# EAGLE design MBHP_CORE_STM32F4v1.1.12 (EAGLE 7.1.0)
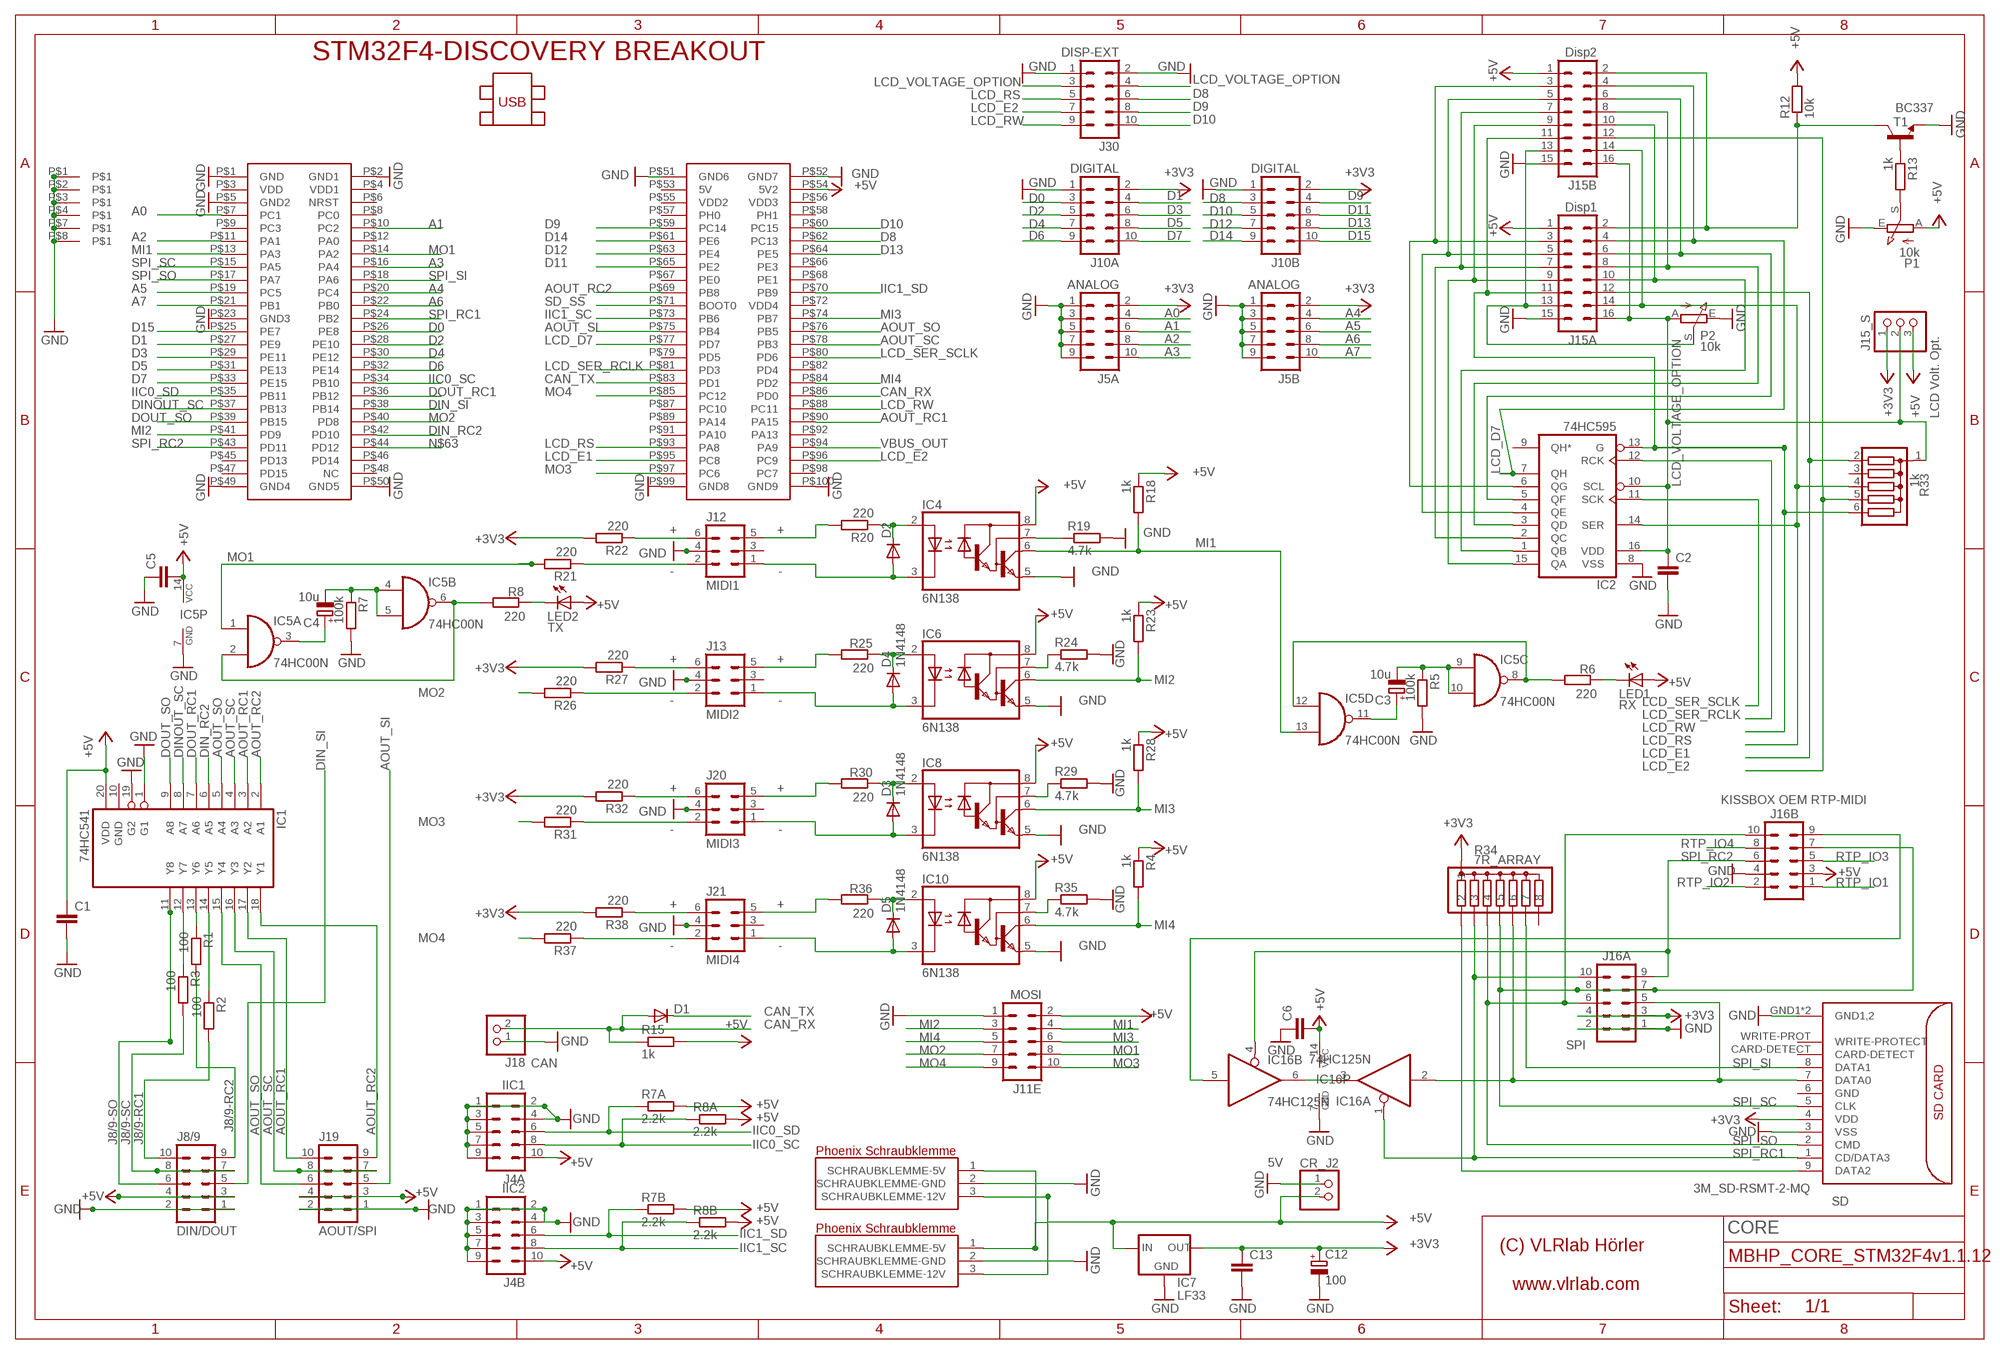
[diagram p0: schematic, sheet 1]

## Parts
C1  C-EU025-025X050  [C025-025X050]
C2  C-EU025-025X050  [C025-025X050]
C3  10u  CPOL-EUE2.5-6  [E2,5-6]
C4  10u  CPOL-EUE2.5-6  [E2,5-6]
C5  C-EU025-025X050  [C025-025X050]
C6  C-EU025-025X050  [C025-025X050]
C12  100  CPOL-EUE5-10.5  [E5-10,5]
C13  C-EU025-025X050  [C025-025X050]
CR_J2  5V  PINHD-1X2  [1X02]
D1  1N4148  1N4148DO35-7  [DO35-7]
D2  1N4148DO35-7  [DO35-7]
D3  1N4148  1N4148DO35-7  [DO35-7]
D4  1N4148  1N4148DO35-7  [DO35-7]
D5  1N4148  1N4148DO35-7  [DO35-7]
IC1  74HC541  [DIL20]
IC2  74HC595  [DIL16]
IC4  6N138  6N138DIL  [DIL08]
IC5  74HC00N  74AC00N  [DIL14]
IC6  6N138  6N138DIL  [DIL08]
IC7  LF33  [TO220]
IC8  6N138  6N138DIL  [DIL08]
IC10  6N138  6N138DIL  [DIL08]
IC16  74HC125N  [DIL14]
J1A  PT-1.5/3  [PT-1.5/3-5.0]
J1B  PT-1.5/3  [PT-1.5/3-5.0]
J4A  IIC1  ML10  [ML10]
J4B  IIC2  ML10  [ML10]
J5A  ANALOG  ML10  [ML10]
J5B  ANALOG  ML10  [ML10]
J8/9  DIN/DOUT  ML10  [ML10]
J10A  DIGITAL  ML10  [ML10]
J10B  DIGITAL  ML10  [ML10]
J11E  MOSI  ML10  [ML10]
J12  MIDI1  ML6  [ML6]
J13  MIDI2  ML6  [ML6]
J15_S  LCD Volt. Opt.  PINHD-1X3  [1X03]
J15A  Disp1  ML16  [ML16]
J15B  Disp2  ML16  [ML16]
J16A  SPI  ML10  [ML10]
J16B  KISSBOX OEM RTP-MIDI  ML10  [ML10]
J18  CAN  PINHD-1X2  [1X02]
J19  AOUT/SPI  ML10  [ML10]
J20  MIDI3  ML6  [ML6]
J21  MIDI4  ML6  [ML6]
J30  DISP-EXT  ML10  [ML10]
LED1  RX  LED3MM  [LED3MM]
LED2  TX  LED3MM  [LED3MM]
OUTLINE  MIDIBOX_FULL  [MIDIBOX14X12]
P1  10k  PHIER_6MM  [6MM_V]
P2  10k  PHIER_6MM  [6MM_V]
R1  100  R-EU_0204/7  [0204/7]
R2  100  R-EU_0204/7  [0204/7]
R3  100  R-EU_0204/7  [0204/7]
R4  1k  R-EU_0204/7  [0204/7]
R5  100k  R-EU_0204/7  [0204/7]
R6  220  R-EU_0204/7  [0204/7]
R7  100k  R-EU_0204/7  [0204/7]
R7A  2.2k  R-EU_0204/7  [0204/7]
R7B  2.2k  R-EU_0204/7  [0204/7]
R8  220  R-EU_0204/7  [0204/7]
R8A  2.2k  R-EU_0204/7  [0204/7]
R8B  2.2k  R-EU_0204/7  [0204/7]
R12  10k  R-EU_0204/7  [0204/7]
R13  1k  R-EU_0204/7  [0204/7]
R15  1k  R-EU_0204/7  [0204/7]
R18  1k  R-EU_0204/7  [0204/7]
R19  4.7k  R-EU_0204/7  [0204/7]
R20  220  R-EU_0204/7  [0204/7]
R21  220  R-EU_0204/7  [0204/7]
R22  220  R-EU_0204/7  [0204/7]
R23  1k  R-EU_0204/7  [0204/7]
R24  4.7k  R-EU_0204/7  [0204/7]
R25  220  R-EU_0204/7  [0204/7]
R26  220  R-EU_0204/7  [0204/7]
R27  220  R-EU_0204/7  [0204/7]
R28  1k  R-EU_0204/7  [0204/7]
R29  4.7k  R-EU_0204/7  [0204/7]
R30  220  R-EU_0204/7  [0204/7]
R31  220  R-EU_0204/7  [0204/7]
R32  220  R-EU_0204/7  [0204/7]
R33  1k  4306R  [SIL6]
R34  7R_ARRAY  [SIL8]
R35  4.7k  R-EU_0204/7  [0204/7]
R36  220  R-EU_0204/7  [0204/7]
R37  220  R-EU_0204/7  [0204/7]
R38  220  R-EU_0204/7  [0204/7]
SD  3M_SD-RSMT-2-MQ  [3M_SD-RSMT-2-MQ]
STM32F4DISCOVERY  STM32F4-DISCOVERY  [STM32F4-DISCOVERY]
T1  BC337  [TO92]

## Nets
+3V3 [SDcard]: C12.+ C13.1 IC7.OUT J5A.2 J5B.2 J10A.2 J10B.2 J15_S.1 J16A.3 J16A.4 R22.2 R27.2 R32.2 R34.1 R38.2 SD.4(VDD)
+5V [VDD]: C1.1 C5.2 C6.2 CR_J2.2 IC1.20(VDD) IC4.8(VCC) IC5.14(P:VCC) IC6.8(VCC) IC7.IN IC8.8(VCC) IC10.8(VCC) IC16.14(P:VCC) J1A.1(SCHRAUBKLEMME-5V) J1B.1(SCHRAUBKLEMME-5V) J4A.10 J4B.10 J8/9.3 J8/9.4 J11E.2 J15_S.3 J15A.1 J15B.1 J16B.3 J19.3 J19.4 LED1.A LED2.A P1.A R4.1 R7A.2 R7B.2 R8A.2 R8B.2 R12.2 R15.2 R18.1 R23.1 R28.1 STM32F4DISCOVERY.P$54(5V2)
+12V1 [10V]: J1A.3(SCHRAUBKLEMME-12V) J1B.3(SCHRAUBKLEMME-12V)
A0: J5A.4 STM32F4DISCOVERY.P$7(PC1)
A1: J5A.6 STM32F4DISCOVERY.P$10(PC2)
A2: J5A.8 STM32F4DISCOVERY.P$11(PA1)
A3: J5A.10 STM32F4DISCOVERY.P$16(PA4)
A4: J5B.4 STM32F4DISCOVERY.P$20(PC4)
A5: J5B.6 STM32F4DISCOVERY.P$19(PC5)
A6: J5B.8 STM32F4DISCOVERY.P$22(PB0)
A7: J5B.10 STM32F4DISCOVERY.P$21(PB1)
AOUT_RC1: IC1.3(A2) IC1.17(Y2) J19.10 STM32F4DISCOVERY.P$90(PA15)
AOUT_RC2: IC1.2(A1) IC1.18(Y1) J19.9 STM32F4DISCOVERY.P$69(PB8)
AOUT_SC: IC1.4(A3) IC1.16(Y3) J19.7 J19.8 STM32F4DISCOVERY.P$78(PB3)
AOUT_SI: J19.5 STM32F4DISCOVERY.P$75(PB4)
AOUT_SO: IC1.5(A4) IC1.15(Y4) J19.6 STM32F4DISCOVERY.P$76(PB5)
CAN_RX: D1.A J18.2 R15.1 STM32F4DISCOVERY.P$86(PD0)
CAN_TX: D1.C STM32F4DISCOVERY.P$83(PD1)
CR_M1-: D2.A IC4.3(C) J12.1
CR_M2+$1: D2.C IC4.2(A) R20.1
D0: J10A.3 STM32F4DISCOVERY.P$26(PE8)
D1: J10A.4 STM32F4DISCOVERY.P$27(PE9)
D2: J10A.5 STM32F4DISCOVERY.P$28(PE10)
D3: J10A.6 STM32F4DISCOVERY.P$29(PE11)
D4: J10A.7 STM32F4DISCOVERY.P$30(PE12)
D5: J10A.8 STM32F4DISCOVERY.P$31(PE13)
D6: J10A.9 STM32F4DISCOVERY.P$32(PE14)
D7: J10A.10 STM32F4DISCOVERY.P$33(PE15)
D8: J10B.3 J30.6 STM32F4DISCOVERY.P$62(PC13)
D9: J10B.4 J30.8 STM32F4DISCOVERY.P$59(PC14)
D10: J10B.5 J30.10 STM32F4DISCOVERY.P$60(PC15)
D11: J10B.6 STM32F4DISCOVERY.P$65(PE2)
D12: J10B.7 STM32F4DISCOVERY.P$63(PE4)
D13: J10B.8 STM32F4DISCOVERY.P$64(PE5)
D14: J10B.9 STM32F4DISCOVERY.P$61(PE6)
D15: J10B.10 STM32F4DISCOVERY.P$25(PE7)
DIN_RC2: IC1.6(A5) STM32F4DISCOVERY.P$42(PD10)
DIN_SI: J8/9.5 STM32F4DISCOVERY.P$38(PB14)
DINOUT_SC: IC1.8(A7) STM32F4DISCOVERY.P$37(PB13)
DOUT_RC1: IC1.7(A6) STM32F4DISCOVERY.P$36(PB12)
DOUT_SO: IC1.9(A8) STM32F4DISCOVERY.P$39(PB15)
GND: C1.2 C2.2 C5.1 C6.1 C12.- C13.2 CR_J2.1 IC1.1(G1) IC1.19(G2) IC2.8(VSS) IC4.5(GND) IC5.7(P:GND) IC6.5(GND) IC7.GND IC8.5(GND) IC10.5(GND) IC16.7(P:GND) J1A.2(SCHRAUBKLEMME-GND) J1B.2(SCHRAUBKLEMME-GND) J4A.1 J4A.2 J4A.3 J4A.4 J4A.5 J4A.7 J4A.9 J4B.1 J4B.2 J4B.3 J4B.4 J4B.5 J4B.7 J4B.9 J5A.1 J5A.3 J5A.5 J5A.7 J5A.9 J5B.1 J5B.3 J5B.5 J5B.7 J5B.9 J8/9.1 J8/9.2 J10A.1 J10B.1 J11E.1 J12.4 J13.4 J15A.15 J15B.15 J16A.1 J16A.2 J16B.4 J18.1 J19.1 J19.2 J20.4 J21.4 J30.1 J30.2 OUTLINE.P$1 OUTLINE.P$2 OUTLINE.P$3 OUTLINE.P$4 OUTLINE.P$7 OUTLINE.P$8 P1.E P2.E R5.2 R7.2 R19.2 R24.2 R29.2 R35.2 SD.3(VSS) SD.GND1(GND1,2) SD.GND2(GND1,2) STM32F4DISCOVERY.P$1(GND) STM32F4DISCOVERY.P$2(GND1) STM32F4DISCOVERY.P$5(GND2) STM32F4DISCOVERY.P$23(GND3) STM32F4DISCOVERY.P$49(GND4) STM32F4DISCOVERY.P$50(GND5) STM32F4DISCOVERY.P$51(GND6) STM32F4DISCOVERY.P$52(GND7) STM32F4DISCOVERY.P$99(GND8) STM32F4DISCOVERY.P$100(GND9) T1.1(E)
IIC0_SC: J4A.8 R8A.1 STM32F4DISCOVERY.P$34(PB10)
IIC0_SD: J4A.6 R7A.1 STM32F4DISCOVERY.P$35(PB11)
IIC1_SC: J4B.8 R8B.1 STM32F4DISCOVERY.P$73(PB6)
IIC1_SD: J4B.6 R7B.1 STM32F4DISCOVERY.P$70(PB9)
J8/9-RC1: J8/9.10 R2.2
J8/9-RC2: J8/9.9 R1.2
J8/9-SC: J8/9.7 J8/9.8 R3.2
J8/9-SO: IC1.11(Y8) J8/9.6
LCD_D7: IC2.7(QH) J15A.4 J15B.4 STM32F4DISCOVERY.P$77(PD7)
LCD_E1: J15A.12 R33.2 STM32F4DISCOVERY.P$95(PC8)
LCD_E2: J15B.12 J30.7 R33.5 STM32F4DISCOVERY.P$96(PC9)
LCD_RS: IC2.14(SER) J15A.14 J15B.14 J30.5 R33.4 STM32F4DISCOVERY.P$93(PA8)
LCD_RW: IC2.13(G) J15A.11 J15B.11 J30.9 R33.6 STM32F4DISCOVERY.P$88(PC11)
LCD_SER_RCLK: IC2.12(RCK) STM32F4DISCOVERY.P$81(PD3)
LCD_SER_SCLK: IC2.11(SCK) STM32F4DISCOVERY.P$80(PD6)
LCD_VOLTAGE_OPTION [VDD]: C2.1 IC2.10(SCL) IC2.16(VDD) J15_S.2 J15A.16 J15B.16 J30.3 J30.4 P2.A R33.1
MF_M+ZULEITUNG: J13.5 R25.2
MF_M+ZULEITUNG1: J20.5 R30.2
MF_M+ZULEITUNG2: J21.5 R36.2
MF_M-ZULEITUNG: D4.A IC6.3(C) J13.1
MF_M-ZULEITUNG1: D3.A IC8.3(C) J20.1
MF_M-ZULEITUNG2: D5.A IC10.3(C) J21.1
MI1: IC4.6(VO) IC5.13(D:I1) J11E.4 R18.2 STM32F4DISCOVERY.P$13(PA3)
MI2: IC6.6(VO) J11E.3 R23.2 STM32F4DISCOVERY.P$41(PD9)
MI3: IC8.6(VO) J11E.6 R28.2 STM32F4DISCOVERY.P$74(PB7)
MI4: IC10.6(VO) J11E.5 R4.2 STM32F4DISCOVERY.P$84(PD2)
MO1: IC5.1(A:I0) J11E.8 R21.2 STM32F4DISCOVERY.P$14(PA2)
MO2: J11E.7 R26.2 STM32F4DISCOVERY.P$40(PD8)
MO3: J11E.10 R31.2 STM32F4DISCOVERY.P$97(PC6)
MO4: J11E.9 R37.2 STM32F4DISCOVERY.P$85(PC12)
N$1: IC2.6(QG) J15A.3 J15B.3
N$2: IC2.5(QF) J15A.6 J15B.6
N$3: IC2.4(QE) J15A.5 J15B.5
N$4: IC2.3(QD) J15A.8 J15B.8
N$5: R34.2 SD.9(DATA2)
N$6: IC16.5(B:I) J16B.9
N$7: R34.7 SD.8(DATA1)
N$8: IC2.2(QC) J15A.7 J15B.7
N$9: IC2.1(QB) J15A.10 J15B.10
N$10: IC2.15(QA) J15A.9 J15B.9
N$11: IC4.7(VB) R19.1
N$12: J15A.13 J15B.13 P2.S
N$13: IC16.3(A:O) IC16.6(B:O)
N$14: P1.S R13.2
N$15: R13.1 T1.2(B)
N$16: J12.6 R22.1
N$18: J15A.2 J15B.2 R12.1 T1.3(C)
N$19: D4.C IC6.2(A) R25.1
N$20: J12.5 R20.2
N$21: C3.- IC5.9(C:I0) IC5.10(C:I1) R5.1
N$22: C3.+ IC5.11(D:O)
N$23: IC5.8(C:O) IC5.12(D:I0) R6.2
N$24: J12.3
N$25: J13.6 R27.1
N$26: J13.2 R26.1
N$27: LED1.K(C) R6.1
N$28: D3.C IC8.2(A) R30.1
N$29: IC8.7(VB) R29.1
N$30: J20.6 R32.1
N$31: J20.2 R31.1
N$32: D5.C IC10.2(A) R36.1
N$33: IC10.7(VB) R35.1
N$34: J21.6 R38.1
N$35: J21.2 R37.1
N$36: IC5.4(B:I0) IC5.5(B:I1)
N$37: C4.- R7.1
N$39: C4.+ IC5.3(A:O)
N$40: IC5.2(A:I1) IC5.6(B:O) R8.2
N$42: LED2.K(C) R8.1
N$63: STM32F4DISCOVERY.P$44(PD12)
N$81: J12.2 R21.1
N$99: IC6.7(VB) R24.1
RC-I-: IC1.14(Y5) R2.1
RC-O-: IC1.13(Y6) R1.1
RTP_IO1: J16B.1
RTP_IO2: J16B.2
RTP_IO3: J16B.5
RTP_IO4: J16B.8
SC-: IC1.12(Y7) R3.1
SD_SS: STM32F4DISCOVERY.P$71(BOOT0)
SPI_RC1: IC16.1(A:OE) J16A.10 R34.3 SD.1(CD/DATA3) STM32F4DISCOVERY.P$24(PB2)
SPI_RC2: IC16.4(B:OE) J16A.9 J16B.6 STM32F4DISCOVERY.P$43(PD11)
SPI_SC: J16A.7 J16A.8 J16B.7 R34.5 SD.5(CLK) STM32F4DISCOVERY.P$15(PA5)
SPI_SI: IC16.2(A:I) J16A.5 R34.6 SD.7(DATA0) STM32F4DISCOVERY.P$18(PA6)
SPI_SO: J16A.6 J16B.10 R34.4 SD.2(CMD) STM32F4DISCOVERY.P$17(PA7)
VBUS_OUT: STM32F4DISCOVERY.P$94(PA9)
Unconnected: IC2.9(QH*) IC16.8(C:O) IC16.9(C:I) IC16.10(C:OE) IC16.11(D:O) IC16.12(D:I) IC16.13(D:OE) J13.3 J20.3 J21.3 R33.3 R34.8 SD.6(GND) SD.CARD-DETECT SD.WRITE-PROT(WRITE-PROTECT) STM32F4DISCOVERY.P$3(VDD) STM32F4DISCOVERY.P$4(VDD1) STM32F4DISCOVERY.P$6(NRST) STM32F4DISCOVERY.P$8(PC0) STM32F4DISCOVERY.P$9(PC3) STM32F4DISCOVERY.P$12(PA0) STM32F4DISCOVERY.P$45(PD13) STM32F4DISCOVERY.P$46(PD14) STM32F4DISCOVERY.P$47(PD15) STM32F4DISCOVERY.P$48(NC) STM32F4DISCOVERY.P$53(5V) STM32F4DISCOVERY.P$55(VDD2) STM32F4DISCOVERY.P$56(VDD3) STM32F4DISCOVERY.P$57(PH0) STM32F4DISCOVERY.P$58(PH1) STM32F4DISCOVERY.P$66(PE3) STM32F4DISCOVERY.P$67(PE0) STM32F4DISCOVERY.P$68(PE1) STM32F4DISCOVERY.P$72(VDD4) STM32F4DISCOVERY.P$79(PD5) STM32F4DISCOVERY.P$82(PD4) STM32F4DISCOVERY.P$87(PC10) STM32F4DISCOVERY.P$89(PA14) STM32F4DISCOVERY.P$91(PA10) STM32F4DISCOVERY.P$92(PA13) STM32F4DISCOVERY.P$98(PC7)

## Notes on the sheet
- + | +
- - | -
- + | +
- - | -
- + | +
- - | -
- + | +
- - | -
- CORE

## Power pins joined to a net without a drawn wire
GND: IC1.10(GND)

## Library data of the parts
C1 C2 C5 C6 C13 = rcl:C-EU: CAPACITOR, European symbol
C3 C4 C12 = rcl:CPOL-EU: POLARIZED CAPACITOR, European symbol
CR_J2 J18 = pinhead_Ivan:PINHD-1X2: PIN HEADER
D1-D5 = diode:1N4148: DIODE high speed (Philips)
IC1 = 595-541-165-uln2803:74HC541
IC2 = 74-595:74HC595
IC4 IC6 IC8 IC10 = 6N138:6N138DIL
IC5 = 74xx-eu:74*00: Quad 2-input NAND gate
IC7 = LF33:LF33
IC16 = 74xx-eu:74*125: Quad bus BUFFER, 3-state
J1A J1B = Phonenix Contacts:PT-1.5/3
J4A J4B J5A J5B J8/9 J10A J10B J11E J16A J16B J19 J30 = con-harting-ml:ML10: HARTING; OC_FARNELL: unknown; OC_NEWARK: unknown
J12 J13 J20 J21 = con-harting-ml:ML6: HARTING; OC_FARNELL: unknown; OC_NEWARK: unknown
J15_S = pinhead_Ivan:PINHD-1X3: PIN HEADER
J15A J15B = con-ml:ML16: HARTING; OC_FARNELL: unknown; OC_NEWARK: unknown
LED1 LED2 = led:LED: LED OSRAM: - CHIPLED LG R971, LG N971, LY N971, LG Q971, LY Q971, LO R971, LY R971 LH N974, LH R974 LS Q976, LO Q976, LY Q976 LO Q996 - Hyper CHIPLED LW Q18S LB Q993, LB Q99A, LB R99A - SideLED LS A670, LO A670, LY A670, LG A670, LP A670 LB A673, LV A673, LT A673, LW A673 LH A674 LY A675 LS A676, LA A676, LO A676, LY A676, LW A676 LS A679, LY A679, LG A679 - Hyper Micro SIDELED® LS Y876, LA Y876, LO Y876, LY Y876 LT Y87S - SmartLED LW L88C, LW L88S LB L89C, LB L89S, LG L890 LS L89K, LO L89K, LY L89K LS L896, LA L896, LO L896, LY L896 - TOPLED LS T670, LO T670, LY T670, LG T670, LP T670 LSG T670, LSP T670, LSY T670, LOP T670, LYG T670 LG T671, LOG T671, LSG T671 LB T673, LV T673, LT T673, LW T673 LH T674 LS T676, LA T676, LO T676, LY T676, LB T676, LH T676, LSB T676, LW T676 LB T67C, LV T67C, LT T67C, LS T67K, LO T67K, LY T67K, LW E67C LS E67B, LA E67B, LO E67B, LY E67B, LB E67C, LV E67C, LT E67C LW T67C LS T679, LY T679, LG T679 LS T770, LO T770, LY T770, LG T770, LP T770 LB T773, LV T773, LT T773, LW T773 LH T774 LS E675, LA E675, LY E675, LS T675 LS T776, LA T776, LO T776, LY T776, LB T776 LHGB T686 LT T68C, LB T68C - Hyper Mini TOPLED® LB M676 - Mini TOPLED Santana® LG M470 LS M47K, LO M47K, LY M47K Source: http://www.osram.convergy.de LUXEON: - LUMILED® LXK2-PW12-R00, LXK2-PW12-S00, LXK2-PW14-U00, LXK2-PW14-V00 LXK2-PM12-R00, LXK2-PM12-S00, LXK2-PM14-U00 LXK2-PE12-Q00, LXK2-PE12-R00, LXK2-PE12-S00, LXK2-PE14-T00, LXK2-PE14-U00 LXK2-PB12-K00, LXK2-PB12-L00, LXK2-PB12-M00, LXK2-PB14-N00, LXK2-PB14-P00, LXK2-PB14-Q00 LXK2-PR12-L00, LXK2-PR12-M00, LXK2-PR14-Q00, LXK2-PR14-R00 LXK2-PD12-Q00, LXK2-PD12-R00, LXK2-PD12-S00 LXK2-PH12-R00, LXK2-PH12-S00 LXK2-PL12-P00, LXK2-PL12-Q00, LXK2-PL12-R00 Source: www.luxeon.com KINGBRIGHT: KA-3528ASYC Source: www.kingbright.com
OUTLINE = Frames_VLR:MIDIBOX_FULL
P1 P2 = Potentiometer 6mm:PHIER_6MM
R1-R3 R7A R7B R8A R8B = rcl:R-EU_: RESISTOR, European symbol
R4-R8 R12 R13 R15 R18-R32 R35-R38 = resistor:R-EU_: RESISTOR, European symbol
R33 = Bourns Resistor Array:4306R
R34 = Bourns Resistor Array:7R_ARRAY
SD = Memory:3M_SD-RSMT-2-MQ
STM32F4DISCOVERY = STM32F4-DISCOVERY:STM32F4-DISCOVERY
T1 = transistor:BC337: NPN TRANSISTOR

## Net classes
0 default: width 0.254 mm, drill 0.33 mm, clearance 0.254 mm
1 VDD: width 0.61 mm, drill 0.33 mm, clearance 0.406 mm to class 0, clearance 0.406 mm
2 10V: width 1.016 mm, drill 0.33 mm, clearance 0.406 mm to class 0, clearance 0.406 mm to class 1, clearance 0.254 mm
3 SDcard: width 0.406 mm, drill 0.33 mm, clearance 0.406 mm to class 0, clearance 0.406 mm to class 1, clearance 0.406 mm to class 2, clearance 0.406 mm

## Board
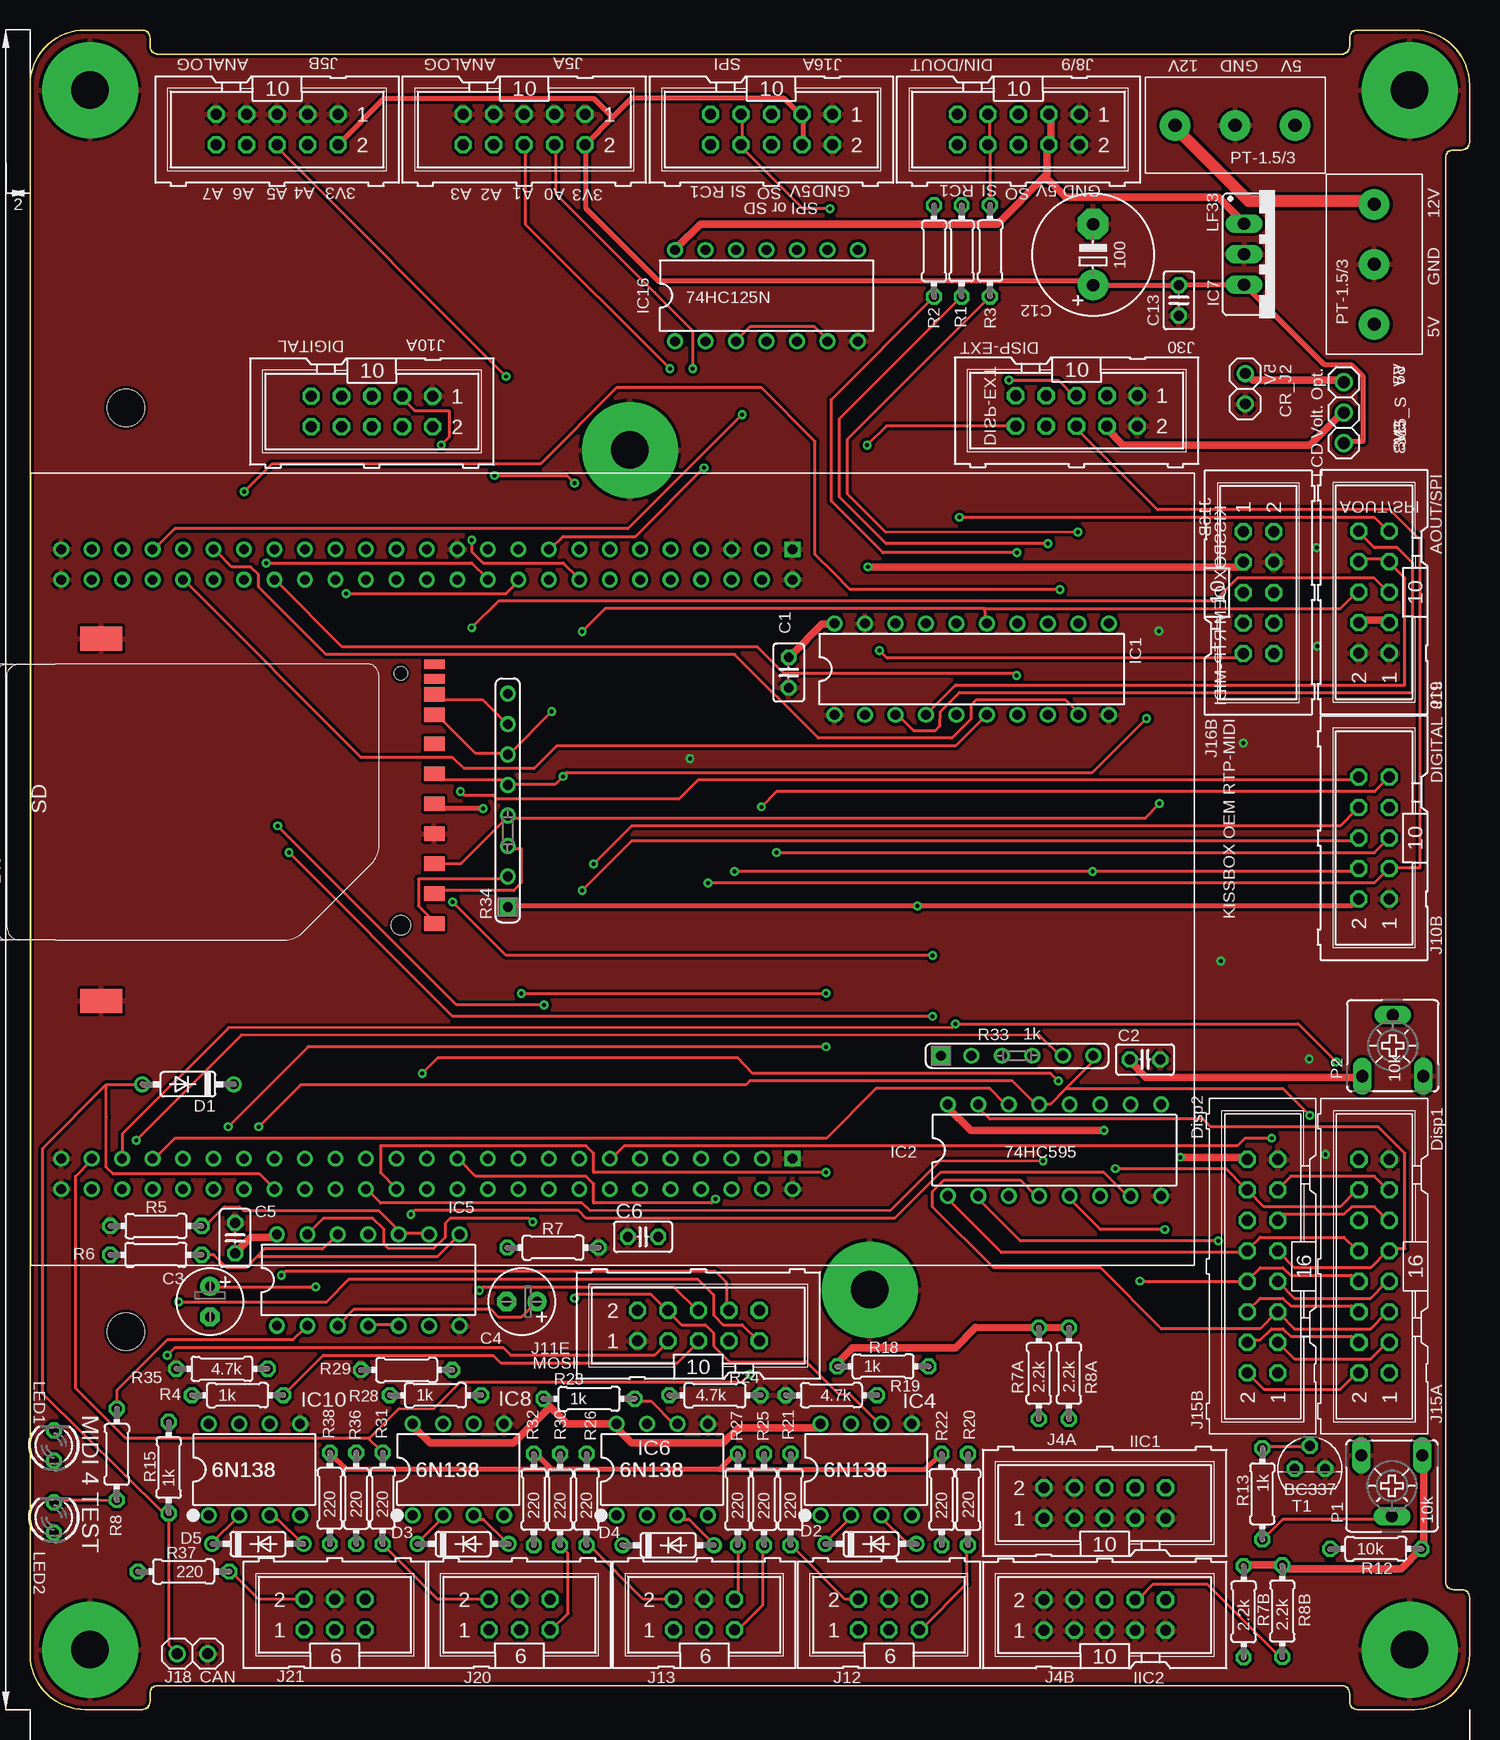
[diagram p1: board, top side]
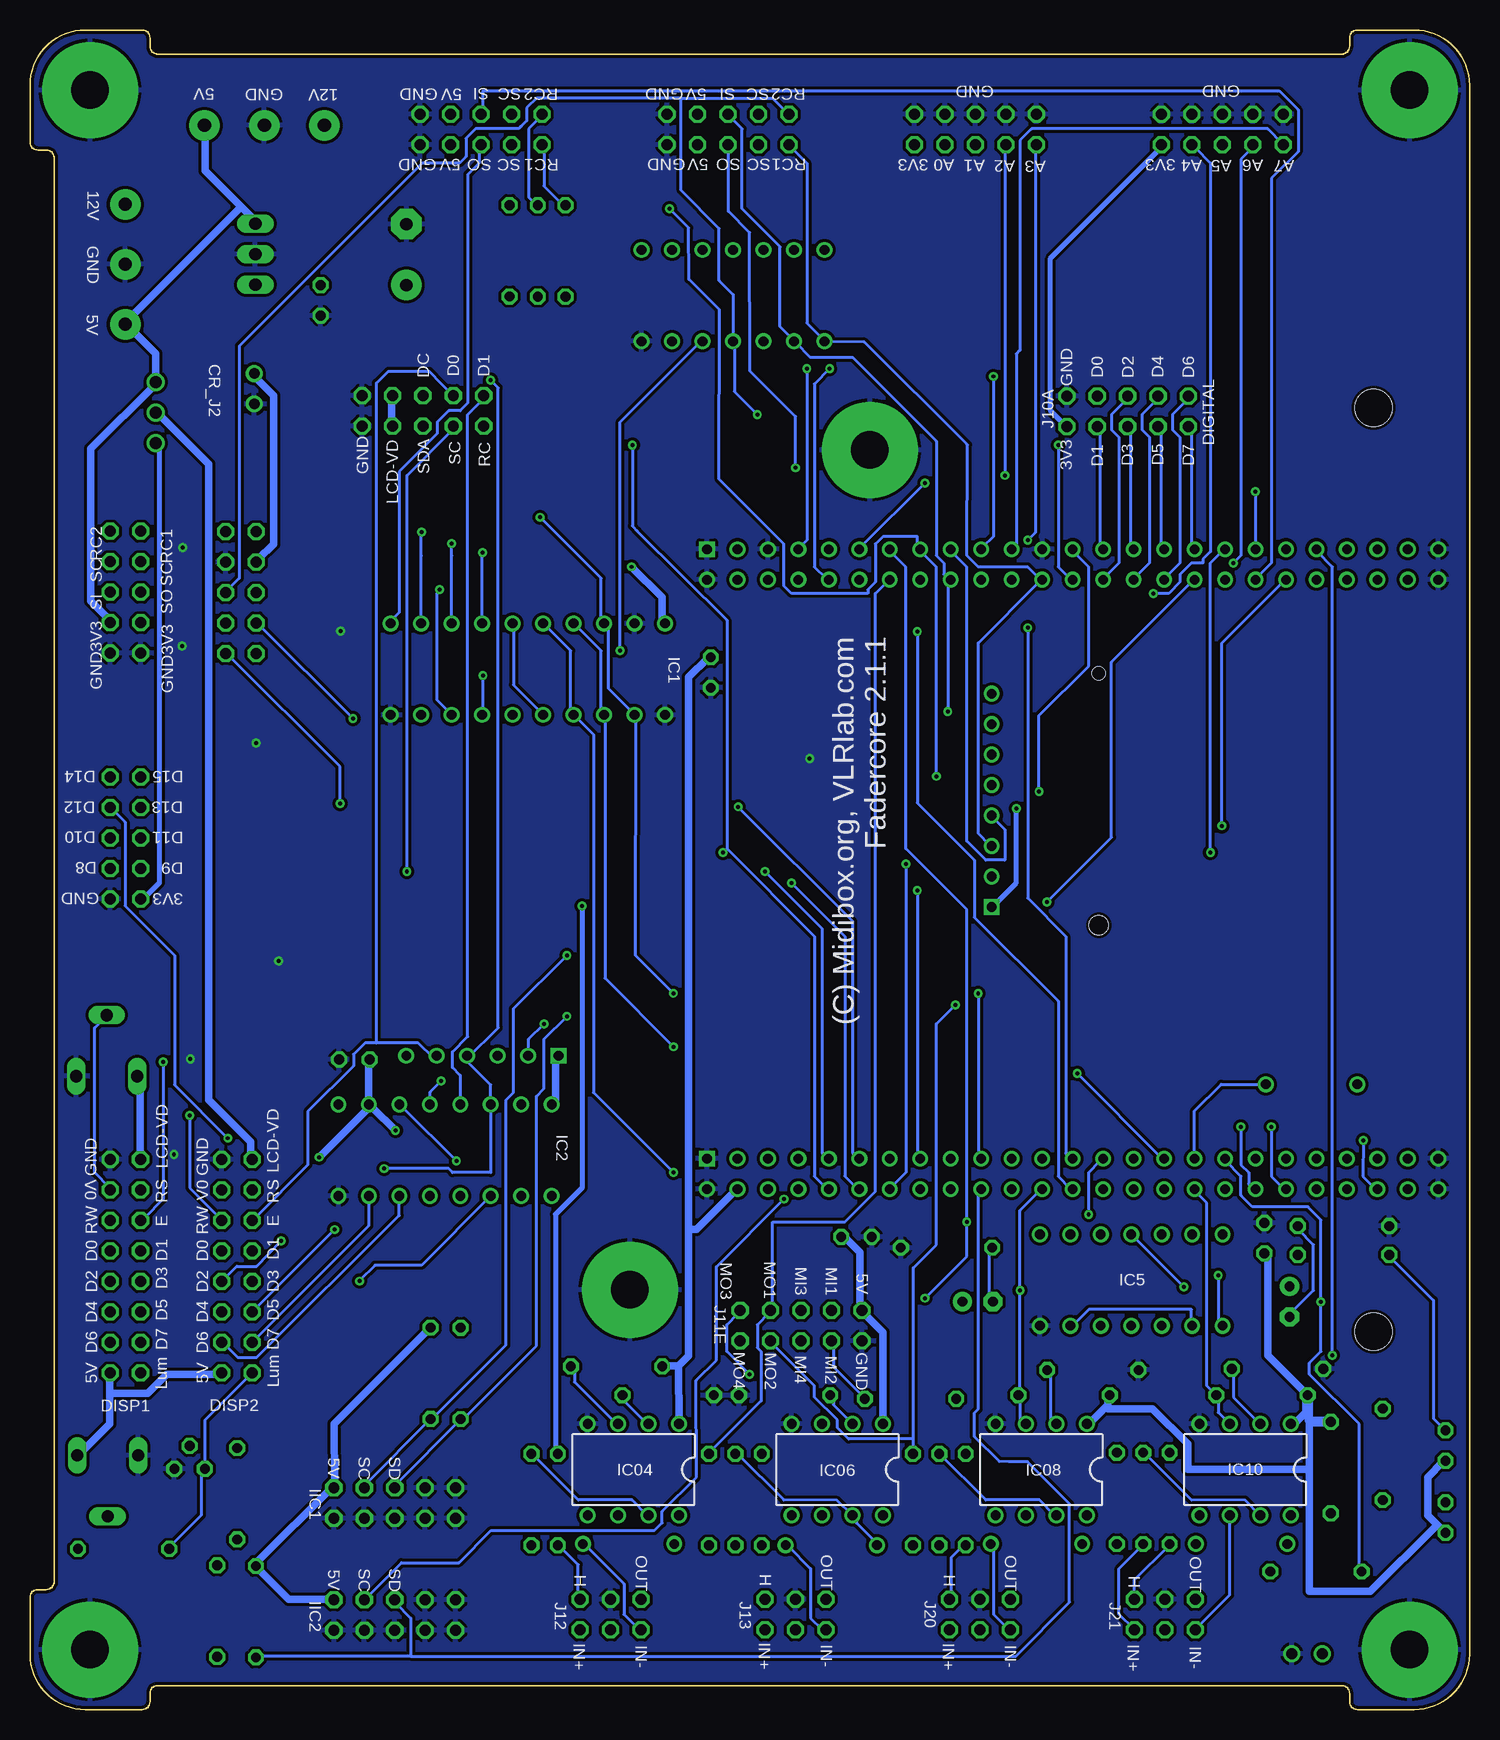
[diagram p2: board, bottom side, seen from below]

Size 120 x 140 mm. Coordinates in mm from the lower left corner, seen from the top.
Copper layers (1*16): Top 0.035mm / dielectric 1.5mm / Bottom 0.035mm
Design rules "makePCB *": minimum track width 10mil, minimum drill 13mil, track to track 10mil, track to pad 8mil, pad to pad 8mil, via to via 8mil, smd to smd 8mil, copper to edge 10mil, drill to drill 10mil, minimum pad ring 10mil, minimum via ring 8mil, stop-mask expansion 4mil, vias tented up to drill 0mil, thermal gap 10mil
Holes 3.1 mm at 8,108.5 8,31.5

### Footprints (pad centres in the part's own frame; a part is rotated, then mirrored left to right if it is on the bottom)
C025-025X050 = drill 0.813 octagon: 1 -1.27,0; 2 1.27,0
E2,5-6 = drill 0.813 pad 1.6: + -1.27,0 | drill 0.813 pad 1.6 octagon: - 1.27,0
E5-10,5 = drill 1.016 pad 2.54: + -2.54,0 | drill 1.016 pad 2.54 octagon: - 2.54,0
1X02 = drill 0.9: 1 -1.27,0; 2 1.27,0
DO35-7 = drill 0.813: A 3.81,0; C -3.81,0
DIL20 = drill 0.813: 1 -11.43,-3.81; 2 -8.89,-3.81; 3 -6.35,-3.81; 4 -3.81,-3.81; 5 -1.27,-3.81; 6 1.27,-3.81; 7 3.81,-3.81; 8 6.35,-3.81; 9 8.89,-3.81; 10 11.43,-3.81; 11 11.43,3.81; 12 8.89,3.81; 13 6.35,3.81; 14 3.81,3.81; 15 1.27,3.81; 16 -1.27,3.81; 17 -3.81,3.81; 18 -6.35,3.81; 19 -8.89,3.81; 20 -11.43,3.81
DIL16 = drill 0.813: 1 -8.89,-3.81; 2 -6.35,-3.81; 3 -3.81,-3.81; 4 -1.27,-3.81; 5 1.27,-3.81; 6 3.81,-3.81; 7 6.35,-3.81; 8 8.89,-3.81; 9 8.89,3.81; 10 6.35,3.81; 11 3.81,3.81; 12 1.27,3.81; 13 -1.27,3.81; 14 -3.81,3.81; 15 -6.35,3.81; 16 -8.89,3.81
DIL08 = drill 0.813: 1 -3.81,-3.81; 2 -1.27,-3.81; 3 1.27,-3.81; 4 3.81,-3.81; 5 3.81,3.81; 6 1.27,3.81; 7 -1.27,3.81; 8 -3.81,3.81
DIL14 = drill 0.813: 1 -7.62,-3.81; 2 -5.08,-3.81; 3 -2.54,-3.81; 4 0,-3.81; 5 2.54,-3.81; 6 5.08,-3.81; 7 7.62,-3.81; 8 7.62,3.81; 9 5.08,3.81; 10 2.54,3.81; 11 0,3.81; 12 -2.54,3.81; 13 -5.08,3.81; 14 -7.62,3.81
TO220 = drill 1.016 long: GND 0,0; IN -2.54,0; OUT 2.54,0
PT-1.5/3-5.0 = drill 1.1 pad 2.54: 1 5,0; 2 0,0; 3 -5,0
ML10 = drill 0.914 octagon: 1 -5.08,-1.27; 2 -5.08,1.27; 3 -2.54,-1.27; 4 -2.54,1.27; 5 0,-1.27; 6 0,1.27; 7 2.54,-1.27; 8 2.54,1.27; 9 5.08,-1.27; 10 5.08,1.27
ML6 = drill 0.914 octagon: 1 -2.54,-1.27; 2 -2.54,1.27; 3 0,-1.27; 4 0,1.27; 5 2.54,-1.27; 6 2.54,1.27
1X03 = drill 1.016: 1 -2.54,0; 2 0,0; 3 2.54,0
ML16 = drill 0.914 octagon: 1 -8.89,-1.27; 2 -8.89,1.27; 3 -6.35,-1.27; 4 -6.35,1.27; 5 -3.81,-1.27; 6 -3.81,1.27; 7 -1.27,-1.27; 8 -1.27,1.27; 9 1.27,-1.27; 10 1.27,1.27; 11 3.81,-1.27; 12 3.81,1.27; 13 6.35,-1.27; 14 6.35,1.27; 15 8.89,-1.27; 16 8.89,1.27
LED3MM = drill 0.813 octagon: A -1.27,0; K 1.27,0
MIDIBOX14X12 = drill 3.1 pad 8: P$1 5,135; P$2 50,105; P$3 70,35; P$4 5,5; P$7 115,135; P$8 115,5
6MM_V = drill 1.016 long: A -2.54,-2.54; E 2.54,-2.54; S 0,2.54
0204/7 = drill 0.813 octagon: 1 -3.81,0; 2 3.81,0
SIL6 = drill 0.813 square: 1 -6.35,0 | drill 0.813: 2 -3.81,0; 3 -1.27,0; 4 1.27,0; 5 3.81,0; 6 6.35,0
SIL8 = drill 0.813 square: 1 -6.35,0 | drill 0.813: 2 -3.81,0; 3 -1.27,0; 4 1.27,0; 5 3.81,0; 6 6.35,0; 7 8.89,0; 8 11.43,0
3M_SD-RSMT-2-MQ = smd 1.2 x 1.7: 1 22.16,31.6; 2 19.66,31.6; 3 17.16,31.6; 4 14.66,31.6; 5 12.16,31.6; 6 9.66,31.6; 7 7.23,31.6; 8 5.53,31.6; 9 24.66,31.6 | smd 0.8 x 1.7: CARD-DETECT 4.23,31.6; WRITE-PROT 3.03,31.6 | smd 2 x 3.5: GND1 0.9,3.85; GND2 31.1,3.85 | hole 1.6: 24.78,28.8 | hole 1.1: 3.78,28.8
STM32F4-DISCOVERY = drill 0.8 square: P$1 -27.94,30.48; P$51 22.86,30.48 | drill 0.8: P$2 -25.4,30.48; P$3 -27.94,27.94; P$4 -25.4,27.94; P$5 -27.94,25.4; P$6 -25.4,25.4; P$7 -27.94,22.86; P$8 -25.4,22.86; P$9 -27.94,20.32; P$10 -25.4,20.32; P$11 -27.94,17.78; P$12 -25.4,17.78; P$13 -27.94,15.24; P$14 -25.4,15.24; P$15 -27.94,12.7; P$16 -25.4,12.7; P$17 -27.94,10.16; P$18 -25.4,10.16; P$19 -27.94,7.62; P$20 -25.4,7.62; P$21 -27.94,5.08; P$22 -25.4,5.08; P$23 -27.94,2.54; P$24 -25.4,2.54; P$25 -27.94,0; P$26 -25.4,0; P$27 -27.94,-2.54; P$28 -25.4,-2.54; P$29 -27.94,-5.08; P$30 -25.4,-5.08; P$31 -27.94,-7.62; P$32 -25.4,-7.62; P$33 -27.94,-10.16; P$34 -25.4,-10.16; P$35 -27.94,-12.7; P$36 -25.4,-12.7; P$37 -27.94,-15.24; P$38 -25.4,-15.24; P$39 -27.94,-17.78; P$40 -25.4,-17.78; P$41 -27.94,-20.32; P$42 -25.4,-20.32; P$43 -27.94,-22.86; P$44 -25.4,-22.86; P$45 -27.94,-25.4; P$46 -25.4,-25.4; P$47 -27.94,-27.94; P$48 -25.4,-27.94; P$49 -27.94,-30.48; P$50 -25.4,-30.48; P$52 25.4,30.48; P$53 22.86,27.94; P$54 25.4,27.94; P$55 22.86,25.4; P$56 25.4,25.4; P$57 22.86,22.86; P$58 25.4,22.86; P$59 22.86,20.32; P$60 25.4,20.32; P$61 22.86,17.78; P$62 25.4,17.78; P$63 22.86,15.24; P$64 25.4,15.24; P$65 22.86,12.7; P$66 25.4,12.7; P$67 22.86,10.16; P$68 25.4,10.16; P$69 22.86,7.62; P$70 25.4,7.62; P$71 22.86,5.08; P$72 25.4,5.08; P$73 22.86,2.54; P$74 25.4,2.54; P$75 22.86,0; P$76 25.4,0; P$77 22.86,-2.54; P$78 25.4,-2.54; P$79 22.86,-5.08; P$80 25.4,-5.08; P$81 22.86,-7.62; P$82 25.4,-7.62; P$83 22.86,-10.16; P$84 25.4,-10.16; P$85 22.86,-12.7; P$86 25.4,-12.7; P$87 22.86,-15.24; P$88 25.4,-15.24; P$89 22.86,-17.78; P$90 25.4,-17.78; P$91 22.86,-20.32; P$92 25.4,-20.32; P$93 22.86,-22.86; P$94 25.4,-22.86; P$95 22.86,-25.4; P$96 25.4,-25.4; P$97 22.86,-27.94; P$98 25.4,-27.94; P$99 22.86,-30.48; P$100 25.4,-30.48
TO92 = drill 0.813 octagon: 1 1.27,0; 2 0,1.905; 3 -1.27,0

### Placement (x,y rotation side)
C1  63.25,86.44 270 top
C2  92.95,54.18 0 top
C3  15,34 270 top
C4  41,34 180 top
C5  17.1,39.3 270 top
C6  51.1,39.4 0 top
C12  88.62,121.28 90 top
C13  95.77,117.46 270 top
CR_J2  101.3,110.1 90 top
D1  13.17,52.12 180 top
D2  70.1,13.8 0 top
D3  36.1,13.8 0 top
D4  53.2,13.7 0 top
D5  19,13.8 0 top
IC1  78.5,86.72 0 top
IC2  85.4,46.62 0 top
IC4  69.7,20 0 top
IC5  28.2,35.8 0 top
IC6  52.7,20 0 top
IC7  101.22,121.31 270 top
IC8  35.7,20 0 top
IC10  18.7,20 0 top
IC16  61.4,117.86 0 top
J1A  100.46,132.06 0 top
J1B  112.06,120.47 270 top
J4A  89.59,17.22 0 top
J4B  89.59,7.87 0 top
J5A  41.2,131.7 180 top
J5B  20.6,131.7 180 top
J8/9  82.4,131.7 180 top
J10A  28.5,108.2 180 top
J10B  112.04,72.65 90 top
J11E  55.71,32 0 top
J12  71.6,7.9 0 top
J13  56.2,7.9 0 top
J15_S  109.52,108.11 90 top
J15A  112.06,36.95 90 top
J15B  102.76,36.95 90 top
J16A  61.8,131.7 180 top
J16B  102.4,93.1 270 top
J18  13.55,4.66 180 top
J19  112.04,93.13 90 top
J20  40.8,7.9 0 top
J21  25.4,7.9 0 top
J30  87.25,108.27 180 top
LED1  2,22 90 top
LED2  2,16 90 top
OUTLINE  0,0 0 top
P1  113.53,18.64 180 top
P2  113.6,55.34 0 top
R1  77.66,121.58 90 top
R2  75.36,121.58 90 top
R3  80.03,121.59 90 top
R4  17.3,26.2 0 top
R5  10.5,40.3 180 top
R6  10.5,37.9 0 top
R7  43.6,38.5 0 top
R7A  84.1,28.01 90 top
R7B  101.17,8.15 90 top
R8  7.24,21.27 90 top
R8A  86.61,28.03 90 top
R8B  104.39,8.2 90 top
R12  112.2,13.39 0 top
R13  102.73,17.99 270 top
R15  11.56,20.17 90 top
R18  71.1,28.6 0 top
R19  66.8,26.2 180 top
R20  78.2,17.5 270 top
R21  63.4,17.5 90 top
R22  76,17.5 90 top
R23  46.6,25.9 0 top
R24  57.1,26.2 0 top
R25  61.2,17.5 270 top
R26  46.4,17.5 90 top
R27  59,17.5 90 top
R28  33.8,26.2 0 top
R29  31.4,28.3 180 top
R30  44.2,17.5 270 top
R31  29.4,17.6 90 top
R32  42,17.5 90 top
R33  82.28,54.5 0 top
R34  39.83,73.24 90 top
R35  16,28.4 180 top
R36  27.2,17.6 270 top
R37  12.8,11.5 180 top
R38  25,17.6 90 top
SD  2.1,90.16 270 top
STM32F4DISCOVERY  33.08,68.78 270 top
T1  106.7,20.06 0 top
U$6  [VLRLAB]  1.23,104.67 90 bottom
U$7  [VLRLAB]  1.23,128.77 270 top

### Tracks (layer width: path | path; a pad name or v marks a point on that pad's centre or on a via)
+3V3  (via drill 0.33)
  Top 0.406: 48.58,132.72 50.16,134.3 62.87,134.3 64.14,133.03 J16A.3 64.45,132.72 64.45,130.49 J16A.4 | 48.58,132.72 46.35,130.49 J5A.2 46.35,130.18 46.35,125.09 52.39,119.06 88.27,119.06 88.58,118.75 C12.+ 88.9,118.75 95.57,118.75 C13.1 95.89,118.75 100.97,118.75 IC7.OUT 101.28,118.75 107.95,112.08 110.17,112.08 111.12,111.12 111.12,105.73 109.54,105.73 J15_S.1 | 48.58,132.72 46.99,134.3 29.53,134.3 25.72,130.49 J5B.2 | 43.5,20 42.23,21.27 R32.2 | 57.47,20 43.5,20 | 57.47,20 58.74,21.27 R27.2 | 43.5,20 26.35,20 25.08,21.27 R38.2 | 57.47,20 74.61,20 75.88,21.27 R22.2 | v37.78,75.11 33.97,75.11 SD.4 | R34.1 40.01,66.99 v73.98,66.99 110.17,66.99 110.49,67.31 J10B.2
  Bottom 0.406: J5B.2 25.72,130.18 34.92,120.97 34.92,108.27 33.66,107 J10A.2 | v37.78,75.11 37.78,68.9 39.69,66.99 R34.1 | J10B.2 110.49,67.63 109.22,68.9 109.22,105.41 J15_S.1 | v73.98,66.99 73.98,43.5 76.2,41.27 76.2,21.59 R22.2
+5V  (via drill 0.33)
  Top 0.61: 84.61,127.79 84.77,127.95 84.77,130.18 J8/9.4 85.09,130.49 85.09,132.72 J8/9.3 | 84.61,127.79 80.64,123.83 55.88,123.83 53.98,121.92 IC16.14 | J19.4 110.81,90.81 113.03,90.81 J19.3 | CR_J2.2 101.6,111.12 101.92,110.81 109.22,110.81 J15_S.3 | 84.61,127.79 84.77,127.64 86.36,126.05 99.06,126.05 100.97,124.14 IC7.IN | P1.A 116.2,20.95 116.2,13.65 R12.2 115.89,13.34 114.3,11.75 104.46,11.75 R8B.2 104.14,12.06 101.28,12.06 R7B.2 | C5.2 17.14,38.1 18.41,39.37 20.32,39.37 IC5.14 | 43.34,25.24 44.77,23.81 48.58,23.81 IC6.8 48.9,23.5 50.16,22.23 57.78,22.23 59.05,23.5 65.72,23.5 IC4.8 | 43.34,25.24 42.86,25.72 R23.1 | IC8.8 32.07,23.5 33.34,22.23 40.32,22.23 43.18,25.08 43.34,25.24 | C1.1 63.5,87.95 66.04,90.49 66.99,90.49 IC1.20 | R18.1 67.31,28.89 68.58,30.16 77.15,30.16 78.82,31.84 78.81,31.85 R7A.2 86.61,31.86 R8A.2 | v69.85,95.25 100.65,95.25 100.97,95.57 J16B.3 | 52.39,39.37 C6.2 52.39,39.37
  Bottom 0.61: 102.39,125.25 105.41,128.27 105.41,131.76 J1A.1 | 102.39,125.25 101.28,124.14 IC7.IN | J16B.3 100.97,95.89 99.69,97.16 99.69,109.54 101.28,111.12 CR_J2.2 | J19.3 113.35,90.81 114.94,92.39 114.94,105.09 109.54,110.49 J15_S.3 109.54,110.81 109.54,113.03 111.76,115.25 J1B.1 111.76,115.57 111.76,115.89 102.55,125.09 102.39,125.25 | 113.33,26.35 110.17,26.35 109.22,27.3 108.6,27.94 104.14,27.94 J15B.1 | 113.33,26.35 113.33,27.94 J15A.1 | 113.33,26.35 113.33,23.82 115.89,21.27 P1.A | J4B.10 94.93,9.21 98.42,9.2 100.97,11.75 R7B.2 100.97,12.06 100.97,12.38 94.93,18.41 J4A.10 94.61,18.73 94.65,23.8 86.72,31.74 R8A.2 | 2.7,15.4 3.49,16.19 3.49,19.37 2.22,20.64 LED1.A | 2.7,15.4 2.22,14.92 LED2.A | IC10.8 14.61,23.81 13.65,24.77 13.65,26.04 R4.1 | R4.1 13.65,26.35 16.83,29.53 16.83,37.78 C5.2 | 13.34,20 13.34,24.12 13.34,26.04 R4.1 | 13.34,20 13.34,9.84 8.26,9.84 2.86,15.24 2.7,15.4 | C6.2 52.07,39.37 50.8,38.1 50.8,33.34 J11E.2 50.48,33.02 48.9,31.43 IC6.8 | 30.32,25.24 30.16,25.4 30.16,26.04 R28.1 | 30.32,25.24 31.75,23.81 IC8.8 | 65.09,40.01 65.09,31.45 65.09,29.48 65.92,28.64 | 65.09,40.01 64.45,40.01 61.28,43.18 STM32F4DISCOVERY.P$54 | 65.92,28.64 65.9,23.84 IC4.8 | R18.1 67.32,28.65 65.92,28.64 | 65.09,40.01 65.09,86.04 63.5,87.63 C1.1 | 13.34,20 23.5,20 23.5,22.14 26.45,25.07 30.16,25.08 30.32,25.24 | v69.85,95.25 67.31,92.71 67.31,90.81 IC1.20
  Bottom 0.813: R15.2 13.19,23.98 13.34,24.12
+12V1
  Top 1.016: J1A.3 95.57,131.76 101.6,125.73 111.76,125.73 J1B.3
A0  (via drill 0.33)
  Top 0.254: v55.24,111.76 55.24,114.94 52.07,118.11 43.81,126.36 43.81,130.18 J5A.4
  Bottom 0.254: v55.24,111.76 55.24,97.47 55.88,96.84 STM32F4DISCOVERY.P$7
A1  (via drill 0.33)
  Top 0.254: v53.34,111.76 41.27,123.83 41.27,130.18 J5A.6
  Bottom 0.254: v53.34,111.76 54.61,110.49 54.61,95.25 53.66,94.3 STM32F4DISCOVERY.P$10
A2  (via drill 0.33)
  Top 0.254: v45.4,102.23 44.77,102.87 v38.73,102.87
  Bottom 0.254: v45.4,102.23 50.8,96.84 STM32F4DISCOVERY.P$11 | v38.73,102.87 38.73,130.18 J5A.8
A3  (via drill 0.33)
  Top 0.254: v36.83,97.47 36.83,96.52 37.78,95.57 44.45,95.57 45.72,94.3 STM32F4DISCOVERY.P$16
  Bottom 0.254: v36.83,97.47 36.2,98.11 36.2,130.18 J5A.10
A4  (via drill 0.33)
  Top 0.254: v26.35,93.03 39.69,93.03 40.64,93.98 STM32F4DISCOVERY.P$20
  Bottom 0.254: v26.35,93.03 25.08,93.03 24.13,93.98 24.13,94.61 23.18,95.57 22.23,95.57 22.23,95.89 21.59,96.52 21.59,128.91 22.86,130.18 J5B.4
A5  (via drill 0.33)
  Top 0.254: v39.69,111.12 20.64,130.18 J5B.6
  Bottom 0.254: v39.69,111.12 39.69,97.79 40.64,96.84 STM32F4DISCOVERY.P$19
A6  (via drill 0.33)
  Top 0.254: v19.68,95.57 36.83,95.57 38.1,94.3 STM32F4DISCOVERY.P$22
  Bottom 0.254: v19.68,95.57 19.05,96.2 19.05,129.22 18.1,130.18 J5B.8
A7
  Bottom 0.254: STM32F4DISCOVERY.P$21 38.1,96.84 37.78,97.16 37.78,112.98 37.47,113.3 37.47,130.81 36.51,131.76 16.82,131.76 15.56,130.49 J5B.10
AOUT_RC1  (via drill 0.33)
  Top 0.254: v16.51,48.58 23.18,55.24 v66.36,55.24 | J19.10 110.81,98.11 112.08,96.84 113.98,96.84 115.25,95.57 115.25,84.77 77.47,84.77 75.88,83.19 75.87,82 75.46,81.6 73.66,81.6 72.39,82.87 IC1.3
  Bottom 0.254: v16.51,48.58 16.51,44.45 15.56,43.5 STM32F4DISCOVERY.P$90 | v66.36,55.24 72.07,60.96 72.07,82.87 IC1.3 72.39,83.19 72.39,88.27 74.61,90.49 IC1.17
AOUT_RC2  (via drill 0.33)
  Top 0.254: v77.47,99.38 112.08,99.38 113.03,98.42 J19.9 | v40.96,59.69 66.36,59.69 v66.37,59.7
  Bottom 0.254: v40.96,59.69 40.96,46.04 STM32F4DISCOVERY.P$69 | v66.37,59.7 69.55,62.88 69.53,82.87 IC1.2 69.85,83.19 71.75,85.09 71.75,90.17 72.07,90.49 IC1.18 72.39,90.81 72.39,94.3 v77.47,99.38
AOUT_SC  (via drill 0.33)
  Top 0.254: J19.8 110.81,95.89 113.03,95.89 J19.7 113.35,95.57 114.62,94.3 114.62,85.41 77.15,85.41 74.93,83.19 IC1.4 | v66.36,44.77 46.99,44.77 46.99,46.35 46.35,46.99 29.21,46.99 29.21,44.77 30.48,43.5 STM32F4DISCOVERY.P$78
  Bottom 0.254: v66.36,44.77 73.03,51.44 73.03,81.28 74.61,82.87 IC1.4 74.93,83.19 74.93,88.27 77.15,90.49 IC1.16
AOUT_SI  (via drill 0.33)
  Top 0.254: v36.83,90.17 39.05,92.39 98.74,92.39 100.65,94.3 112.08,94.3 113.03,93.34 J19.5
  Bottom 0.254: v36.83,90.17 36.83,67.63 33.66,64.45 33.66,46.35 33.34,46.04 STM32F4DISCOVERY.P$75
AOUT_SO  (via drill 0.33)
  Top 0.254: v46.04,89.85 47.94,91.76 79.62,91.76 | 79.62,91.76 79.69,90.81 IC1.15 | 79.62,91.76 109.22,91.76 110.49,93.03 J19.6
  Bottom 0.254: v46.04,89.85 46.04,75.56 41.27,70.8 41.27,66.04 34.29,59.05 34.29,44.45 33.34,43.5 STM32F4DISCOVERY.P$76 | IC1.5 77.47,83.19 79.69,85.41 79.69,90.49 IC1.15
CAN_RX
  Top 0.254: STM32F4DISCOVERY.P$86 19.13,44.63 6.92,44.63 6.36,45.2 6.36,49.4 6.37,52.09 | 6.37,52.09 D1.A | 6.37,52.09 1.07,46.76 1.07,26.31 11.14,16.36 R15.1 11.56,5.38 J18.2
CAN_TX
  Bottom 0.254: STM32F4DISCOVERY.P$83 22.92,49.9 20.69,52.12 17.35,52.12 D1.C
CR_M1-
  Top 0.254: IC4.3 71.12,15.88 73.03,13.97 73.66,13.97 D2.A
  Bottom 0.254: J12.1 69.22,6.67 70.48,7.94 70.48,10.48 73.66,13.65 D2.A
CR_M2+$1
  Top 0.254: D2.C 66.36,13.97 68.26,15.88 IC4.2
  Bottom 0.254: R20.1 78.11,21.27 74.3,17.46 69.83,17.46 68.58,16.19 IC4.2
D0  (via drill 0.33)
  Top 0.254: v34.29,105.41 34.92,106.05 34.92,108.27 32.07,108.27 31.11,109.22 J10A.3
  Bottom 0.254: v34.29,105.41 34.29,95.25 33.34,94.3 STM32F4DISCOVERY.P$26
D1
  Bottom 0.254: STM32F4DISCOVERY.P$27 30.8,96.84 30.8,106.68 J10A.4
D2
  Bottom 0.254: STM32F4DISCOVERY.P$28 30.48,94.3 29.21,95.57 29.21,106.05 29.84,106.68 29.84,107.95 28.57,109.22 J10A.5
D3
  Bottom 0.254: STM32F4DISCOVERY.P$29 28.26,96.84 28.26,106.68 J10A.6
D4
  Bottom 0.254: STM32F4DISCOVERY.P$30 27.94,94.3 26.67,95.57 26.67,106.05 27.3,106.68 27.3,107.95 26.04,109.22 J10A.7
D5
  Bottom 0.254: STM32F4DISCOVERY.P$31 25.72,96.84 25.72,106.68 J10A.8
D6
  Bottom 0.254: STM32F4DISCOVERY.P$32 25.4,94.3 24.13,95.57 24.13,106.05 24.77,106.68 24.77,107.95 23.5,109.22 J10A.9
D7
  Bottom 0.254: STM32F4DISCOVERY.P$33 23.18,96.84 23.18,106.68 J10A.10
D8  (via drill 0.33)
  Top 0.254: v56.52,68.9 112.08,68.9 113.03,69.85 J10B.3 113.35,70.17 115.89,70.17 115.89,97.47 113.35,100.01 93.98,100.01 87.31,106.68 J30.6
  Bottom 0.254: v56.52,68.9 52.07,64.45 52.07,44.45 51.12,43.5 STM32F4DISCOVERY.P$62
D9  (via drill 0.33)
  Top 0.254: v58.74,69.85 v88.58,69.85 110.49,69.85 J10B.4
  Bottom 0.254: v58.74,69.85 53.98,65.09 53.98,46.35 53.66,46.04 STM32F4DISCOVERY.P$59 | v88.58,69.85 88.58,102.87 84.77,106.68 J30.8
D10  (via drill 0.33)
  Top 0.254: v69.79,105.4 71.39,107 81.92,107 J30.10 | v62.23,71.44 112.08,71.44 113.03,72.39 J10B.5
  Bottom 0.254: 61.91,71.75 54.61,64.45 54.61,44.45 53.66,43.5 STM32F4DISCOVERY.P$60 | 61.91,71.75 61.91,90.81 69.38,98.25 69.79,98.65 v69.79,105.4 | 61.91,71.75 v62.23,71.44
D11  (via drill 0.33)
  Top 0.254: v46.04,68.26 50.16,72.39 110.49,72.39 J10B.6
  Bottom 0.254: v46.04,68.26 46.04,46.04 STM32F4DISCOVERY.P$65
D12  (via drill 0.33)
  Top 0.254: v103.5,47.62 101.28,47.62 100.65,46.99 49.53,46.99 48.58,46.04 STM32F4DISCOVERY.P$63
  Bottom 0.254: v103.5,47.62 107.95,52.07 107.95,62.87 112.08,66.99 112.08,73.98 113.03,74.93 J10B.7
D13  (via drill 0.33)
  Top 0.254: v46.99,70.48 50.16,73.66 109.22,73.66 110.49,74.93 J10B.8
  Bottom 0.254: v46.99,70.48 46.99,44.77 48.26,43.5 STM32F4DISCOVERY.P$64
D14  (via drill 0.33)
  Top 0.254: v60.96,75.25 62.23,76.52 112.08,76.52 113.03,77.47 J10B.9
  Bottom 0.254: v60.96,75.25 51.44,65.72 51.44,46.35 51.12,46.04 STM32F4DISCOVERY.P$61
D15  (via drill 0.33)
  Top 0.254: v35.88,76.52 36.2,76.2 38.66,76.2 38.98,75.88 54.1,75.89 55.69,77.48 110.49,77.47 J10B.10
  Bottom 0.254: v35.88,76.52 35.88,82.87 31.75,87 31.75,95.25 33.02,96.52 STM32F4DISCOVERY.P$25
DIN_RC2
  Top 0.254: STM32F4DISCOVERY.P$42 13.02,93.98 27.61,79.35 35.23,79.35 36.2,78.42 42.01,78.42 43.92,80.33 77.15,80.33 79.69,82.87 IC1.6
DIN_SI
  Bottom 0.254: STM32F4DISCOVERY.P$38 17.78,94.3 16.51,95.57 16.51,127.64 14.29,129.86 14.29,133.35 15.88,134.94 82.23,134.94 82.23,133.03 J8/9.5
DINOUT_SC  (via drill 0.33)
  Top 0.254: v17.86,101.51 20.16,103.82 42.55,103.82 48.9,110.17 60.96,110.17 65.46,105.7 65.44,96.28 66.98,94.77 68.36,93.37 v85.85,93.36
  Bottom 0.254: v17.86,101.51 17.86,96.58 STM32F4DISCOVERY.P$37 | v85.85,93.36 86.04,93.04 86.04,84.14 85.09,83.19 IC1.8
DOUT_RC1  (via drill 0.33)
  Top 0.254: v82.25,86.19 82.25,86.22 82.09,86.37 62.87,86.36 60.64,88.58 26.04,88.58 20.64,93.98 STM32F4DISCOVERY.P$36
  Bottom 0.254: v82.25,86.19 82.23,86.06 82.23,83.19 IC1.7
DOUT_SO
  Top 0.254: STM32F4DISCOVERY.P$39 15.56,96.52 16.83,95.25 18.41,95.25 19.05,94.61 19.07,93.56 23.72,88.9 24.68,87.95 58.74,87.95 65.72,80.96 76.83,80.96 78.42,82.55 78.42,83.69 78.87,84.14 78.89,84.16 86.36,84.14 87.31,83.19 IC1.9
GND  (via drill 0.33)
  other vias: 55,79.26 101.16,80.56 94.09,89.9 107.3,88.63 107.26,96.85 99.26,62.4 106.63,54.23 108,46.27
  pour Bottom: -15.6,149.9 125.2,149.9 125.2,-6.7 -15.7,-6.7 -15.7,149.9
  pour Top: -15.4,149.8 125.4,149.8 125.4,-6.8 -15.5,-6.8 -15.5,149.8
IIC0_SC  (via drill 0.33)
  Top 0.254: v35.24,67.31 39.69,62.87 v75.25,62.87
  Bottom 0.254: v35.24,67.31 29.84,72.71 29.84,87.31 23.18,93.98 STM32F4DISCOVERY.P$34 | v75.25,62.87 79.69,58.42 79.69,51.44 80.33,50.8 80.33,30.39 86.36,24.36 R8A.1 86.68,24.22 86.68,24.13 92.08,18.73 J4A.8
IIC0_SD  (via drill 0.33)
  Top 0.254: v21.59,71.44 35.24,57.78 v75.25,57.78
  Bottom 0.254: v21.59,71.44 21.59,95.57 20.64,96.52 STM32F4DISCOVERY.P$35 | v75.25,57.78 77.15,55.88 77.15,51.75 77.79,51.12 77.79,30.32 83.82,24.28 R7A.1 84.11,24.14 84.14,24.13 89.53,18.73 J4A.6
IIC1_SC  (via drill 0.33)
  Top 0.254: v57.15,42.55 56.83,42.23 46.99,42.23 46.99,43.81 46.35,44.45 37.15,44.45 35.88,45.72 STM32F4DISCOVERY.P$73 | R8B.1 104.14,4.45 98.11,10.48 93.66,10.48 92.39,9.21 J4B.8
  Bottom 0.254: v57.15,42.55 62.79,36.91 62.79,29.12 64.48,27.43 64.45,19.37 67.31,16.51 67.31,15.56 67.94,14.92 81.55,14.92 84.24,12.24 89.03,12.24 92.08,9.21 J4B.8
IIC1_SD
  Bottom 0.254: 88.28,4.45 37.8,4.45 33.34,8.94 33.34,17.14 36.84,20.66 38.43,20.66 39.19,20.68 41.26,22.75 41.26,22.76 41.29,22.78 41.29,23.52 41.29,24.71 40.96,25.04 40.96,43.18 STM32F4DISCOVERY.P$70 | 88.28,4.45 88.27,7.62 89.53,8.89 J4B.6 | 88.28,4.45 88.27,4.45 88.28,4.45 | 88.28,4.45 100.97,4.45 R7B.1
J8/9-RC1
  Bottom 0.254: R2.2 75.56,125.41 77.15,127 77.15,130.18 J8/9.10
J8/9-RC2
  Bottom 0.254: R1.2 77.79,125.41 78.42,126.05 78.42,131.76 77.47,132.72 J8/9.9
J8/9-SC
  Top 0.254: R3.2 80.01,125.41 80.01,130.18 J8/9.8 80.01,130.49 80.01,132.72 J8/9.7
J8/9-SO
  Bottom 0.254: IC1.11 89.85,90.81 89.22,91.44 89.22,103.19 86.04,106.36 86.04,107.31 85.09,108.27 84.14,108.27 83.5,108.9 83.5,127.95 82.55,128.91 82.55,130.18 J8/9.6
LCD_D7  (via drill 0.33)
  Top 0.254: v31.75,41.27 32.07,41.59 45.72,41.59 46.35,40.96 72.07,40.96 75.88,44.77 89.53,44.77 91.44,42.86 IC2.7 | J15A.4 110.49,30.8 110.17,31.11 105.09,31.11 104.46,31.75 103.5,31.75 102.55,30.8 101.6,30.8 J15B.4
  Bottom 0.254: v31.75,41.27 31.75,44.77 30.8,45.72 STM32F4DISCOVERY.P$77 | J15B.4 101.28,30.8 91.76,40.32 91.76,42.55 IC2.7
LCD_E1  (via drill 0.33)
  Top 0.254: STM32F4DISCOVERY.P$95 7.7,45.99 7.7,47.98 16.56,56.83 16.57,56.84 76.83,56.83 v77.15,57.15 105.73,57.15 v108.9,53.98
  Bottom 0.254: v77.15,57.15 78.42,55.88 78.42,54.29 R33.2 | v108.9,53.98 108.9,42.55 110.49,40.96 J15A.12
LCD_E2  (via drill 0.33)
  Top 0.254: v8.87,47.45 17.64,56.24 84.14,56.2 86.04,54.29 R33.5
  Bottom 0.254: v8.87,47.45 8.89,44.45 7.94,43.5 STM32F4DISCOVERY.P$96 | 91.12,55.56 87.63,55.56 86.36,54.29 R33.5 | 91.12,55.56 92.08,55.56 93.03,54.61 93.03,53.66 96.84,49.85 96.84,45.4 101.28,40.96 J15B.12 | 91.12,55.56 91.11,110.57 90.12,111.56 86.73,111.56 84.77,109.54 J30.7
LCD_RS  (via drill 0.33)
  Top 0.254: J15A.14 110.49,43.18 109.22,41.91 102.87,41.91 101.6,43.18 J15B.14 101.28,43.5 99.69,45.09 v90.49,45.09 | STM32F4DISCOVERY.P$93 10.48,46.04 12.06,47.62 66.4,47.62 70.52,51.75 80.01,51.75 81.28,50.48 IC2.14 | v81.6,110.81 85.72,110.81 87,109.54 J30.5
  Bottom 0.254: v81.6,110.81 80.96,110.17 80.96,56.83 83.5,54.29 R33.4 83.5,53.98 81.6,52.07 81.6,50.48 IC2.14 81.6,50.16 81.6,44.77 84.77,44.77 85.09,45.09 v90.49,45.09
LCD_RW  (via drill 0.33)
  Top 0.254: J15B.11 104.14,40.96 104.46,41.27 109.54,41.27 110.17,41.91 112.08,41.91 113.03,40.96 J15A.11 | v19.05,48.58 22.54,52.07 59.69,52.08 60.01,52.4 81.92,52.39 83.82,50.48 IC2.13 84.14,50.48 85.09,50.48 86.36,51.75 | 86.36,51.75 88.58,53.98 R33.6 | v106.68,49.53 104.46,51.75 86.36,51.75
  Bottom 0.254: v19.05,48.58 19.05,45.4 18.41,44.77 18.41,43.81 18.1,43.5 STM32F4DISCOVERY.P$88 | J30.9 82.23,109.22 83.5,107.95 83.5,56.1 84.77,54.83 84.77,53.51 84.14,52.87 IC2.13 | v106.68,49.53 106.68,43.5 104.14,40.96 J15B.11
LCD_SER_RCLK  (via drill 0.33)
  Top 0.254: v32.7,53.02 33.97,54.29 59,54.29 60.21,53.03 83.76,53.03 84.82,53.03 85.08,53.03 v85.72,52.39
  Bottom 0.254: v32.7,53.02 25.72,46.04 STM32F4DISCOVERY.P$81 | v85.72,52.39 86.64,51.47 86.65,50.53 IC2.12
LCD_SER_SCLK  (via drill 0.33)
  Top 0.254: v84.45,45.72 75.81,45.7 71.68,41.57 46.67,41.59 46.04,42.23 29.21,42.23 28.26,43.18 STM32F4DISCOVERY.P$80
  Bottom 0.254: v84.45,45.72 88.9,50.16 IC2.11
LCD_VOLTAGE_OPTION  (via drill 0.33)
  Top 0.61: J15_S.2 109.22,107.95 106.68,105.41 91.12,105.41 89.85,106.68 J30.4 | v95.89,46.04 101.28,46.04 J15B.16 | v89.53,48.26 78.42,48.26 76.52,50.16 IC2.16 | P2.A 110.81,52.7 93.03,52.7 91.76,53.98 C2.1
  Bottom 0.61: J30.4 89.85,107 89.85,109.22 J30.3 | J15A.16 110.81,46.04 110.81,52.7 P2.A | IC2.16 76.2,50.48 76.2,53.98 R33.1 | IC2.10 91.76,50.48 91.76,53.98 C2.1 | v95.89,46.04 91.76,50.16 IC2.10 | v89.53,48.26 91.44,50.16 IC2.10 | J15_S.2 109.22,107.95 105.09,103.82 105.09,50.8 101.6,47.31 101.6,46.04 J15B.16
MF_M+ZULEITUNG
  Top 0.254: R25.2 61.11,13.65 61.1,8.71 59.05,6.67 J13.5
MF_M+ZULEITUNG1
  Top 0.254: R30.2 44.84,13.03 44.86,8.01 43.5,6.67 J20.5
MF_M+ZULEITUNG2
  Bottom 0.254: R36.2 27.3,13.65 29.21,11.75 29.21,7.94 27.94,6.67 J21.5
MF_M-ZULEITUNG
  Top 0.254: D4.A 56.83,13.97 54.93,15.88 53.98,15.88 IC6.3
  Bottom 0.254: J13.1 53.98,6.67 54.93,7.62 54.93,11.75 56.83,13.65 D4.A
MF_M-ZULEITUNG1
  Top 0.254: D3.A 39.69,13.97 37.78,15.88 37.15,15.88 IC8.3
  Bottom 0.254: J20.1 38.42,6.67 39.69,7.94 39.69,13.65 D3.A
MF_M-ZULEITUNG2
  Top 0.254: D5.A 22.54,13.97 20.64,15.88 20,15.88 IC10.3
  Bottom 0.254: J21.1 22.86,6.67 20,9.53 20,15.88 IC10.3
MI1  (via drill 0.33)
  Top 0.254: v45.4,34.29 45.72,34.61 51.75,34.61 53.02,33.34 J11E.4 53.34,33.02 54.29,32.07 56.29,32.07 56.3,32.07 56.98,31.38 56.98,30.32 58.31,28.99 64.72,28.98 67.42,26.29 68.31,26.3 70.8,23.81 IC4.6 | v41.91,40.64 41.59,40.96 35.03,40.96 34.61,40.54 34.61,39.37 33.66,38.42 29.91,38.41 29.83,38.47 29.53,38.79 29.53,40.01 28.57,40.96 24.45,40.96 23.18,39.69 IC5.13
  Bottom 0.254: IC4.6 71.12,23.81 74.61,27.3 74.61,28.57 R18.2 | v45.4,34.29 41.91,37.78 v41.91,40.64 41.91,66.67 46.99,71.75 46.99,95.25 48.26,96.52 STM32F4DISCOVERY.P$13
MI2  (via drill 0.33)
  Top 0.254: IC6.6 53.66,23.81 51.75,25.72 50.48,25.72 R23.2 | v11.43,29.53 12.06,30.16 39.46,30.14 40.09,29.5 52.07,29.53 53.02,30.48 J11E.3
  Bottom 0.254: v11.43,29.53 11.43,95.25 12.7,96.52 STM32F4DISCOVERY.P$41 | R23.2 50.48,26.04 53.02,28.57 53.02,30.48 J11E.3
MI3  (via drill 0.33)
  Top 0.254: v37.47,34.92 37.78,35.24 53.66,35.24 55.56,33.34 J11E.6
  Bottom 0.254: STM32F4DISCOVERY.P$74 35.88,43.18 37.47,41.59 v37.47,34.92 37.47,26.35 R28.2 37.47,26.04 37.47,24.13 37.15,23.81 IC8.6
MI4
  Top 0.254: J11E.5 55.56,30.48 53.98,28.89 39.23,28.88 38.59,29.52 24.45,29.53 21.27,26.35 R4.2
  Bottom 0.254: STM32F4DISCOVERY.P$84 22.86,43.18 21.91,42.23 21.91,26.99 21.27,26.35 R4.2 20.95,26.04 20.95,24.77 20,23.81 IC10.6
MO1  (via drill 0.33)
  Top 0.254: v20.95,36.2 21.27,36.51 57.15,36.51 58.1,35.56 58.1,33.34 J11E.8
  Bottom 0.254: STM32F4DISCOVERY.P$14 48.58,93.98 49.53,93.03 49.53,43.18 52.07,40.64 58.1,40.64 58.1,33.34 J11E.8 58.42,33.02 59.37,32.07 59.37,30.16 59.05,29.84 59.05,25.72 63.18,21.59 R21.2 | v20.95,36.2 20.95,32.38 20.64,32.07 IC5.1
MO2  (via drill 0.33)
  Top 0.254: v20.64,73.66 35.56,58.74 v42.86,58.74
  Bottom 0.254: v20.64,73.66 20.64,88.9 15.56,93.98 STM32F4DISCOVERY.P$40 | v42.86,58.74 44.45,57.15 44.45,38.73 46.35,36.83 46.35,22.54 | 46.35,22.54 46.35,21.59 R26.2 | 46.35,22.54 51.75,22.54 52.7,23.5 52.7,24.13 54.61,26.04 54.61,26.99 58.1,30.48 J11E.7
MO3  (via drill 0.33)
  Top 0.254: 28.25,22.55 29.21,21.59 R31.2 | 28.25,22.55 28.32,22.62 24.19,22.62 8.33,22.61 7.98,22.61 3.82,26.76 3.81,44.45 5.08,45.72 STM32F4DISCOVERY.P$97 | v60.01,27.94 59.37,27.3 35.88,27.3 33.66,25.08 30.79,25.09 28.25,22.55
  Bottom 0.254: v60.01,27.94 61.91,29.84 61.91,32.07 60.96,33.02 J11E.10
MO4  (via drill 0.33)
  Top 0.254: v12.38,33.97 24.71,33.97 26.62,35.88 55.59,35.89 55.66,35.88 56.98,34.58 56.98,32.89 57.78,32.07 59.37,32.07 60.64,30.8 J11E.9
  Bottom 0.254: STM32F4DISCOVERY.P$85 20.32,45.72 19.05,44.45 19.05,42.86 18.1,41.91 13.47,41.9 12.38,40.8 v12.38,33.97 12.38,29.84 13.34,28.89 13.34,27.94 9.21,23.81 9.21,11.75 R37.2
N$1
  Top 0.254: J15A.3 113.03,30.48 111.76,29.21 105.41,29.21 104.14,30.48 J15B.3
  Bottom 0.254: IC2.6 89.22,42.55 89.22,42.46 89.22,41.19 101.11,29.34 102.68,29.34 103.19,29.84 103.82,30.48 J15B.3
N$2  (via drill 0.33)
  Top 0.254: v94.61,40.01 89.22,40.01 86.68,42.55 IC2.5 | J15A.6 110.49,33.34 110.17,33.66 105.09,33.66 104.46,34.29 102.55,34.29 101.6,33.34 J15B.6
  Bottom 0.254: v94.61,40.01 101.28,33.34 J15B.6
N$3
  Top 0.254: IC2.4 83.82,42.86 82.55,44.13 76.2,44.13 75.25,43.18 75.25,41.9 75.23,41.88 80.34,36.83 89.27,36.82 94.32,31.71 102.55,31.75 103.82,33.02 J15B.5 104.14,33.02 105.41,31.75 111.76,31.75 113.03,33.02 J15A.5
N$4  (via drill 0.33)
  Top 0.254: J15A.8 110.49,35.88 110.17,36.2 105.09,36.2 104.46,36.83 102.55,36.83 101.6,35.88 J15B.8 92.55,35.68 v92.52,35.71
  Bottom 0.254: IC2.3 87.37,37.03 91.24,37.03 92.52,35.75 v92.52,35.71
N$5
  Top 0.254: SD.9 33.66,65.72 32.38,66.99 32.38,69.22 39.69,69.22 R34.2
N$6  (via drill 0.33)
  Top 0.254: v70.8,88.27 71.44,87.63 100.65,87.63 100.97,87.95 J16B.9
  Bottom 0.254: v70.8,88.27 70.8,107.31 64.14,113.98 IC16.5
N$7
  Top 0.254: SD.8 33.97,84.45 34.29,84.14 37.78,84.14 39.69,82.23 R34.7
N$8  (via drill 0.33)
  Top 0.254: v99.06,39.05 82.55,39.05 79.06,42.55 IC2.2 | J15A.7 113.03,35.56 111.76,34.29 105.41,34.29 104.14,35.56 J15B.7
  Bottom 0.254: v99.06,39.05 101.12,36.94 102.77,36.94 103.82,35.88 J15B.7
N$9
  Top 0.254: IC2.1 76.52,42.55 80.96,38.1 101.28,38.1 J15B.10 101.6,38.42 102.55,39.37 109.54,39.37 110.49,38.42 J15A.10
N$10
  Top 0.254: IC2.15 79.06,50.16 80.01,49.21 97.79,49.21 98.42,48.58 112.39,48.58 114.62,46.35 114.62,38.42 113.35,38.42 J15A.9 113.03,38.1 111.76,36.83 105.41,36.83 104.14,38.1 J15B.9
N$11
  Bottom 0.254: IC4.7 68.58,23.81 70.48,25.72 70.48,26.04 R19.1
N$12
  Top 0.254: J15B.13 104.14,43.5 105.09,44.45 112.08,44.45 113.03,43.5 J15A.13
  Bottom 0.254: P2.S 113.67,57.78 114.62,56.83 114.62,44.77 113.35,43.5 J15A.13
N$13
  Top 0.254: IC16.3 59.05,114.3 60.01,115.25 65.41,115.25 66.36,114.3 IC16.6
N$14
  Top 0.254: R13.2 102.87,14.29 104.46,15.88 113.35,15.88 P1.S
N$15
  Top 0.254: R13.1 102.87,21.91 106.68,21.91 T1.2
N$16
  Bottom 0.254: R22.1 75.88,13.65 74.3,12.06 74.3,9.21 J12.6
N$18
  Top 0.254: J15A.2 110.49,27.94 109.22,26.67 102.87,26.67 101.6,27.94 J15B.2
  Bottom 0.254: R12.1 108.27,13.65 105.73,16.19 105.73,20 T1.3 105.41,20.32 105.41,24.13 101.6,27.94 J15B.2
N$19
  Bottom 0.254: D4.C 49.53,13.97 51.12,15.56 51.12,15.88 IC6.2 52.72,17.44 57.15,17.46 60.96,21.27 R25.1
N$20
  Top 0.254: R20.2 78.11,13.65 78.11,10.5 74.3,6.67 J12.5
N$21
  Top 0.254: IC5.9 33.02,39.69 30.8,39.69 IC5.10 30.72,39.94 29.07,41.59 17.78,41.59 17.46,41.91 16.19,41.91 14.61,40.32 R5.1
  Bottom 0.254: R5.1 14.29,40.01 13.02,38.73 13.02,34.92 14.92,33.02 C3.-
N$22  (via drill 0.33)
  Top 0.254: v23.81,35.24 15.24,35.24 C3.+
  Bottom 0.254: v23.81,35.24 27.94,39.37 IC5.11
N$23
  Top 0.254: 18.95,37.78 19.53,38.38 24.38,38.38 25.4,39.37 IC5.12 | 18.95,37.78 18.01,36.83 16.41,36.83 15.33,37.91 R6.2 | 18.95,37.78 33.97,37.78 35.56,39.37 IC5.8
N$25
  Top 0.254: R27.1 59.05,13.65 59.05,9.21 J13.6
N$26
  Top 0.254: R26.1 46.67,13.65 51.12,9.21 53.66,9.21 J13.2
N$27
  Bottom 0.254: LED1.K 2.22,23.5 3.01,24.27 3.01,34.11 6.67,37.78 R6.1
N$28
  Top 0.254: D3.C 32.38,13.97 34.29,15.88 IC8.2
  Bottom 0.254: R30.1 44.13,21.27 40.32,17.46 35.85,17.48 34.61,16.19 IC8.2
N$29
  Bottom 0.254: IC8.7 34.61,23.81 34.92,24.13 34.92,28.26 R29.1
N$30
  Bottom 0.254: R32.1 42.23,13.65 43.18,12.7 43.18,9.21 J20.6
N$31
  Top 0.254: R31.1 29.53,13.65 33.97,9.21 38.1,9.21 J20.2
N$32
  Top 0.254: D5.C 15.24,13.97 17.14,15.88 IC10.2
  Bottom 0.254: R36.1 26.99,21.27 23.18,17.46 18.69,17.45 17.46,16.19 IC10.2
N$33
  Bottom 0.254: IC10.7 17.46,23.81 19.68,26.04 19.68,28.26 R35.1
N$34
  Bottom 0.254: R38.1 25.08,13.65 27.94,10.79 27.94,9.21 J21.6
N$35
  Top 0.254: R37.1 16.83,11.43 19.05,9.21 22.86,9.21 J21.2
N$36
  Top 0.254: IC5.4 28.26,32.07 30.48,32.07 IC5.5
N$37
  Bottom 0.254: R7.1 40.01,38.42 40.01,34.29 C4.-
N$39
  Top 0.254: IC5.3 25.72,32.07 26.99,33.34 38.42,33.34 39.05,32.7 40.96,32.7 42.23,33.97 C4.+
N$40
  Top 0.254: R8.2 7.24,26.61 11.43,30.8 21.91,30.8 22.86,31.75 IC5.2
  Bottom 0.254: IC5.6 33.02,32.07 31.75,33.34 23.18,33.34 23.18,32.07 IC5.2
N$42
  Top 0.254: R8.1 5.4,17.46 2.22,17.46 LED2.K
N$81
  Top 0.254: R21.1 63.5,13.65 67.94,9.21 68.9,9.21 J12.2
N$99
  Bottom 0.254: IC6.7 53.02,25.4 53.02,26.04 R24.1
RC-I-  (via drill 0.33)
  Top 0.254: v82.27,96.43 71.09,96.43 66.8,100.72 66.8,109.21 R2.1
  Bottom 0.254: IC1.14 82.31,96.17 82.28,96.2 82.28,96.42 v82.27,96.43
RC-O-  (via drill 0.33)
  Top 0.254: v84.85,97.18 71.36,97.18 67.47,101.07 67.47,107.58 R1.1
  Bottom 0.254: IC1.13 84.85,96.16 84.85,96.23 v84.85,97.18
SC-  (via drill 0.33)
  Top 0.254: v87.36,98.13 71.35,98.12 68.14,101.33 68.14,105.89 R3.1
  Bottom 0.254: IC1.12 87.39,96.19 87.39,96.23 87.39,98.09 v87.36,98.13
SPI_RC1
  Top 0.254: SD.1 33.97,68.26 40.32,68.26 40.96,68.9 40.96,71.75 40.01,71.75 R34.3
  Bottom 0.254: J16A.10 56.52,130.18 55.24,128.91 55.24,115.57 53.98,114.3 IC16.1 53.66,113.98 50.48,114.01 41.91,105.47 41.83,105.4 41.91,96.2 40.96,95.25 36.82,95.24 35.88,94.3 STM32F4DISCOVERY.P$24 35.88,93.98 40.96,88.9 40.96,73.03 40.01,72.07 R34.3
SPI_RC2  (via drill 0.33)
  Top 0.254: v59.37,107.95 49.85,98.42 12.06,98.42 10.48,96.84 STM32F4DISCOVERY.P$43
  Bottom 0.254: v59.37,107.95 61.28,109.86 61.28,113.98 IC16.4 61.39,117.96 62.55,119.11 62.55,123.46 65.72,126.63 65.72,134.3 | 65.72,134.3 58.1,134.3 56.83,133.03 J16A.9 | 65.72,134.3 77.79,134.3 78.59,133.5 78.59,132.44 79.06,131.97 79.25,131.78 82.87,131.76 83.66,130.96 83.66,129.48 83.66,129.45 84.19,128.91 87.31,128.91 102.55,113.67 102.55,94.3 103.5,93.34 J16B.6
SPI_SC  (via drill 0.33)
  Top 0.254: J16A.7 59.37,132.72 59.37,130.49 J16A.8 59.37,130.18 64.45,125.09 v66.67,125.09 | SD.5 33.97,77.79 34.29,77.47 39.37,77.47 39.69,77.15 R34.5 40.01,77.15 43.81,77.15 v44.45,77.79 44.77,78.11 88.58,78.11 v93.08,82.61
  Bottom 0.254: v44.45,77.79 44.45,95.25 45.72,96.52 STM32F4DISCOVERY.P$15 46.04,96.84 46.04,97.79 48.9,97.79 49.53,97.16 49.53,93.98 50.16,93.34 50.16,93.03 56.52,93.03 57.15,93.66 57.15,97.16 62.55,102.55 62.53,116.69 65.08,119.23 65.09,123.51 v66.67,125.09 | v93.08,82.61 100.97,90.49 J16B.7
SPI_SI  (via drill 0.33)
  Top 0.254: SD.7 33.97,82.87 37.15,79.69 39.69,79.69 R34.6 40.01,79.69 v43.5,83.19
  Bottom 0.254: J16A.5 61.59,132.72 60.64,131.76 60.64,125.09 57.47,121.92 57.47,115.25 56.52,114.3 IC16.2 56.2,113.98 54.97,112.72 51.44,112.71 44.45,105.73 44.45,96.2 43.81,95.57 43.81,94.61 43.5,94.3 STM32F4DISCOVERY.P$18 43.5,93.98 v43.5,83.19
SPI_SO  (via drill 0.33)
  Top 0.254: SD.2 35.92,70.5 39.41,73.99 39.69,74.3 R34.4 40.01,74.3 92.96,74.31 v94.16,75.53 | v56.2,103.5 50.48,97.79 44.45,97.79 43.5,96.84 STM32F4DISCOVERY.P$17
  Bottom 0.254: STM32F4DISCOVERY.P$17 43.18,96.52 41.91,95.25 41.91,72.39 40.32,70.8 38.73,70.8 38.73,73.34 39.69,74.3 R34.4 | v94.16,75.53 94.16,78.6 103.5,87.95 J16B.10 | v56.2,103.5 56.17,107.77 59.98,111.58 60.01,123.11 61.77,124.88 61.77,130.35 61.78,130.25 J16A.6

### Text on the board
tNames: 12V | GND | 5V | SI | 5V | GND | RC1 | SI | 5V | GND | A7 | A6 | A5 | A4 | 3V3 | A3 | A2 | A1 | A0 | 3V3 | RC1 | SO | SPI or SD | SO | 12V | GND | 5V | DISP-EXT | 5V | 5V | 5V | 3V3 | 3V3 | AOUT/SPI | J16B | KISSBOX OEM RTP-MIDI | J19 | MIDI 4 TEST
bNames: GND | GND | RC2 | SC | SI | 5V | GND | RC2 | SC | SI | 5V | GND | 12V | GND | 5V | A7 | A6 | A5 | A4 | 3V3 | A3 | A2 | A1 | A0 | 3V3 | RC1 | SC | SO | 5V | GND | RC1 | SC | SO | 5V | GND | 12V | GND | 5V | D6 | D4 | D2 | D0 | GND | D1 | D0 | DC | CR_J2 | DIGITAL | J10A | D7 | D5 | D3 | D1 | 3V3 | RC | SC | GND | SDA | LCD-VD | RC1 | RC2 | SC | SC | SO | SI | (C) Midibox.org, VLRlab.com / Fadercore 2.1.1 | 3V3 | 3V3 | IC1 | GND | GND | D15 | D14 | D13 | D12 | D11 | D10 | D9 | D8 | 3V3 | GND | LCD-VD | IC2 | LCD-VD | GND | GND | RS | V0 | RS | V0 | E | RW | E | RW | D1 | D0 | D1 | D0 | IC5 | MI1 | MI3 | MO1 | MO3 | D3 | D2 | D3 | D2 | 5V | D5 | D4 | D5 | D4 | J11E | D7 | D6 | D7 | D6 | GND | MI2 | MI4 | MO2 | MO4 | Lum | 5V | Lum | 5V | DISP2 | DISP1 | IC10 | IC08 | IC06 | IC04 | SD | SC | 5V | IIC1 | OUT | H | OUT | H | OUT | H | OUT | H | SD | SC | 5V | J21 | J20 | J13 | J12 | IIC2 | IN- | IN+ | IN- | IN+ | IN- | IN+ | IN- | IN+